# Altium project STM32MP15XXAC_1LPDDR2x32.PrjPcb
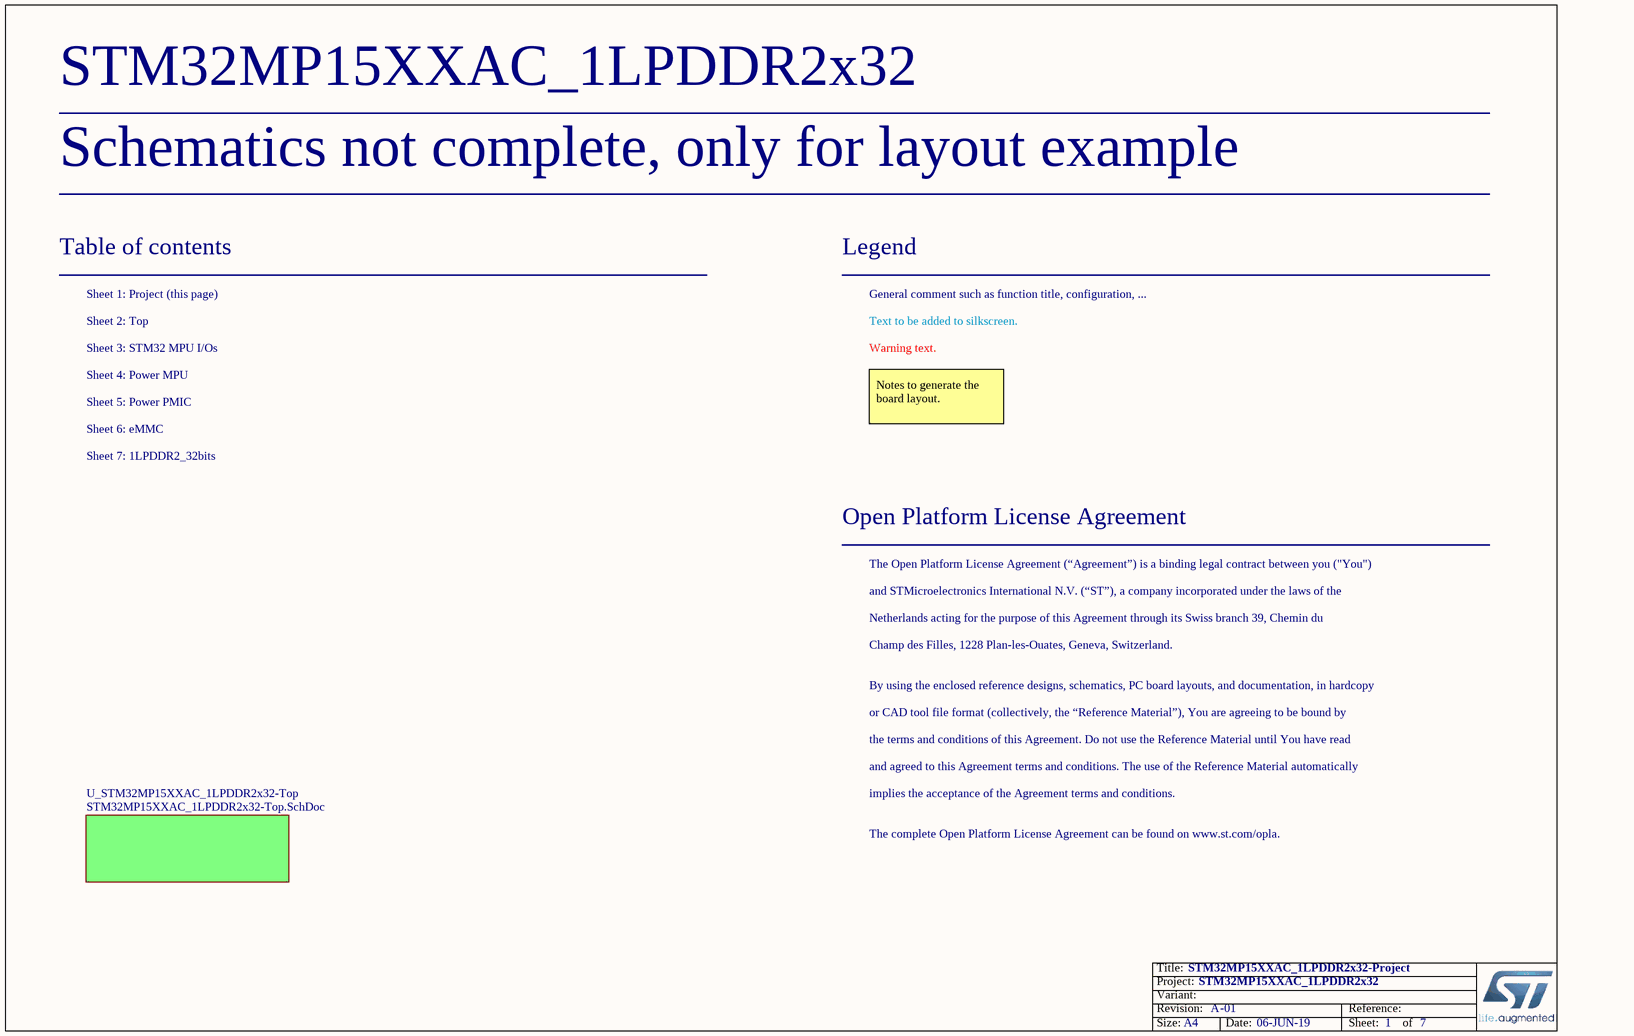
[diagram p0: STM32MP15XXAC_1LPDDR2x32-Project.SchDoc]
Board_Assembly_Revision: 01; Board_Document_Date: 06-JUN-19; Board_Name: STM32MP15XXAC_1LPDDR2x32; Board_PCB_Revision: A
7 sheets, 87 parts. Net scope: flat (ports and power ports of the same name join across sheets).
Board file: STM32MP15XXAC_1LPDDR2x32.PcbDoc
Sheets:
  STM32MP15XXAC_1LPDDR2x32-Project.SchDoc
    U_STM32MP15XXAC_1LPDDR2x32-Top = STM32MP15XXAC_1LPDDR2x32-Top.SchDoc
      U_Power_PMIC = Power_PMIC.SchDoc
      U_Power_MPU = Power_MPU.SchDoc
      U_eMMC = eMMC.SchDoc
      U_STM32_MPU_IOs = STM32_MPU_IOs.SchDoc
      U_1LPDDR2_32bits = 1LPDDR2_32bits .SchDoc

## Sheet STM32MP15XXAC_1LPDDR2x32-Project.SchDoc: STM32MP15XXAC_1LPDDR2x32-Project
size A4; ApprovedBy: Not used; CheckedBy: Not used; Author: Not used; CompanyName: STMicroelectronics; DrawnBy: Not used; Engineer: Not used; Organization: Not used; Address1: Not used; Address2: Not used; Address3: Not used; Address4: Not used; DocumentNumber: Not used; Revision: Not used; SheetNumber: 1; SheetTotal: 7; CurrentTime: Not used; CurrentDate: Not used; Time: Not used; DocumentFullPathAndName: Not used; DocumentName: Not used; ModifiedDate: Not used; ImagePath: Not used; ProjectName: Not used; Application_BuildNumber: Not used

### Sub-sheets
U_STM32MP15XXAC_1LPDDR2x32-Top = STM32MP15XXAC_1LPDDR2x32-Top.SchDoc: no entries

### Notes on the sheet
- Schematics not complete, only for layout example
- Table of contents
- Sheet 1: Project (this page)
- Legend
- General comment such as function title, configuration, ...
- Sheet 2: Top
- Sheet 3: STM32 MPU I/Os
- Sheet 4: Power MPU
- Text to be added to silkscreen.
- Warning text.
- Sheet 5: Power PMIC
- Sheet 6: eMMC
- Notes to generate the board layout.
- Sheet 7: 1LPDDR2_32bits
- Open Platform License Agreement
- The Open Platform License Agreement (“Agreement”) is a binding legal contract between you ("You")
- and STMicroelectronics International N.V. (“ST”), a company incorporated under the laws of the
- Netherlands acting for the purpose of this Agreement through its Swiss branch 39, Chemin du
- Champ des Filles, 1228 Plan-les-Ouates, Geneva, Switzerland.
- By using the enclosed reference designs, schematics, PC board layouts, and documentation, in hardcopy
- or CAD tool file format (collectively, the “Reference Material”), You are agreeing to be bound by
- the terms and conditions of this Agreement. Do not use the Reference Material until You have read
- and agreed to this Agreement terms and conditions. The use of the Reference Material automatically
- implies the acceptance of the Agreement terms and conditions.
- The complete Open Platform License Agreement can be found on www.st.com/opla.
- Title:
- Project:
- Size:
- Revision:
- Variant:
- A4
- -
- Date:
- Reference:
- Sheet:
- of

## Sheet STM32MP15XXAC_1LPDDR2x32-Top.SchDoc: STM32MP15XXAC_1LPDDR2x32-TOP
size A4; Date: Not used; ApprovedBy: Not used; CheckedBy: Not used; Author: Not used; CompanyName: STMicroelectronics; DrawnBy: Not used; Engineer: Not used; Organization: Not used; Address1: Not used; Address2: Not used; Address3: Not used; Address4: Not used; DocumentNumber: Not used; Revision: Not used; SheetNumber: 2; SheetTotal: 7; CurrentTime: Not used; CurrentDate: Not used; Time: Not used; DocumentFullPathAndName: Not used; DocumentName: Not used; ModifiedDate: Not used; ImagePath: Not used; ProjectName: Not used; Application_BuildNumber: Not used
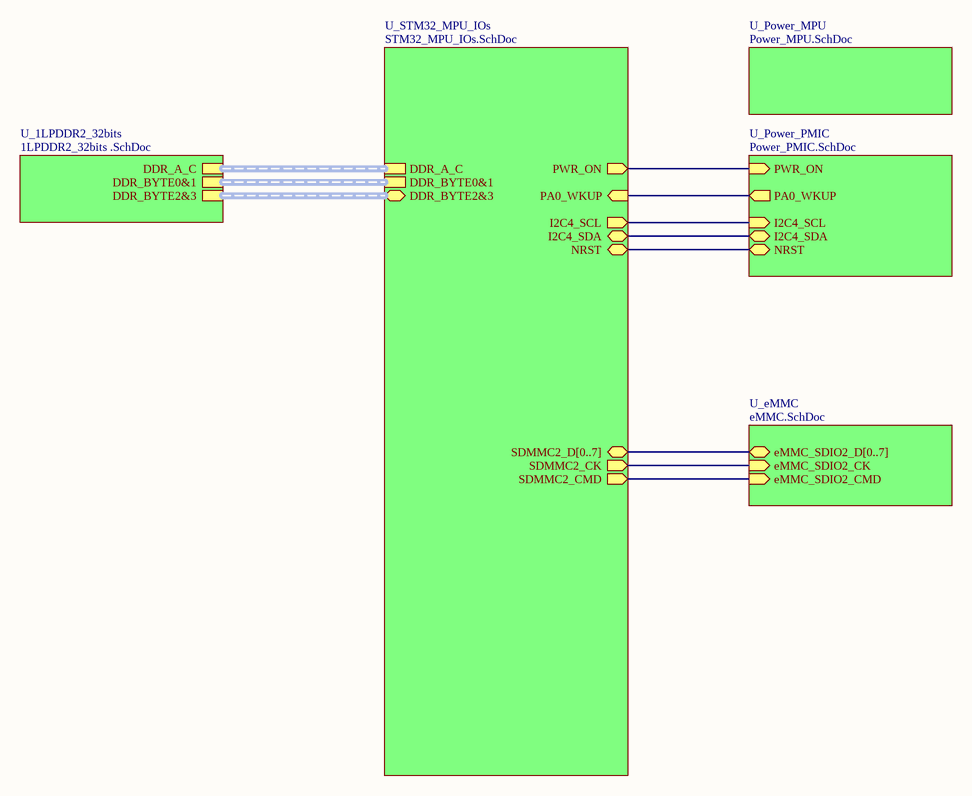
[diagram p1: STM32MP15XXAC_1LPDDR2x32-Top.SchDoc]

### Sub-sheets
U_1LPDDR2_32bits = 1LPDDR2_32bits .SchDoc: DDR_BYTE0&1 (harness DDR_BYTE_0&1), DDR_BYTE2&3 (harness DDR_BYTE_2&3), DDR_A_C (harness DDR_A_C)
U_eMMC = eMMC.SchDoc: eMMC_SDIO2_CK (in), eMMC_SDIO2_D[0..7] (bidir), eMMC_SDIO2_CMD (in)
U_Power_MPU = Power_MPU.SchDoc: no entries
U_Power_PMIC = Power_PMIC.SchDoc: I2C4_SDA (bidir), I2C4_SCL (in), PA0_WKUP (out), NRST (bidir), PWR_ON (in)
U_STM32_MPU_IOs = STM32_MPU_IOs.SchDoc: PA0_WKUP (in), NRST (bidir), PWR_ON (out), I2C4_SCL (out), I2C4_SDA (bidir), DDR_BYTE0&1 (harness DDR_BYTE_0&1), DDR_A_C (harness DDR_A_C), SDMMC2_D[0..7] (bidir), SDMMC2_CMD (out), SDMMC2_CK (out), DDR_BYTE2&3 (harness DDR_BYTE_2&3)

### Nets
(unnamed): sheet U_Power_PMIC/I2C4_SDA, sheet U_STM32_MPU_IOs/I2C4_SDA
(unnamed): sheet U_Power_PMIC/I2C4_SCL, sheet U_STM32_MPU_IOs/I2C4_SCL
(unnamed): sheet U_Power_PMIC/PA0_WKUP, sheet U_STM32_MPU_IOs/PA0_WKUP
(unnamed): sheet U_Power_PMIC/NRST, sheet U_STM32_MPU_IOs/NRST
(unnamed): sheet U_Power_PMIC/PWR_ON, sheet U_STM32_MPU_IOs/PWR_ON
(unnamed): sheet U_eMMC/eMMC_SDIO2_CK, sheet U_STM32_MPU_IOs/SDMMC2_CK
(unnamed): sheet U_eMMC/eMMC_SDIO2_CMD, sheet U_STM32_MPU_IOs/SDMMC2_CMD

### Buses and harness runs
bus sheet U_eMMC/eMMC_SDIO2_D[0..7] = sheet U_STM32_MPU_IOs/SDMMC2_D[0..7]
harness sheet U_1LPDDR2_32bits/DDR_A_C = sheet U_STM32_MPU_IOs/DDR_A_C
harness sheet U_1LPDDR2_32bits/DDR_BYTE0&1 = sheet U_STM32_MPU_IOs/DDR_BYTE0&1
harness sheet U_1LPDDR2_32bits/DDR_BYTE2&3 = sheet U_STM32_MPU_IOs/DDR_BYTE2&3

### Notes on the sheet
- Title:
- Project:
- Size:
- Revision:
- Variant:
- A4
- -
- Date:
- Reference:
- Sheet:
- of

## Sheet Power_PMIC.SchDoc: Power_PMIC
size A3; CompanyName: STMicroelectronics; Organization: Microcontrollers Division; Address1: 12, Rue Jules HOROWITZ; Address2: 38019 Grenoble; Address3: FRANCE; SheetNumber: 5; SheetTotal: 7
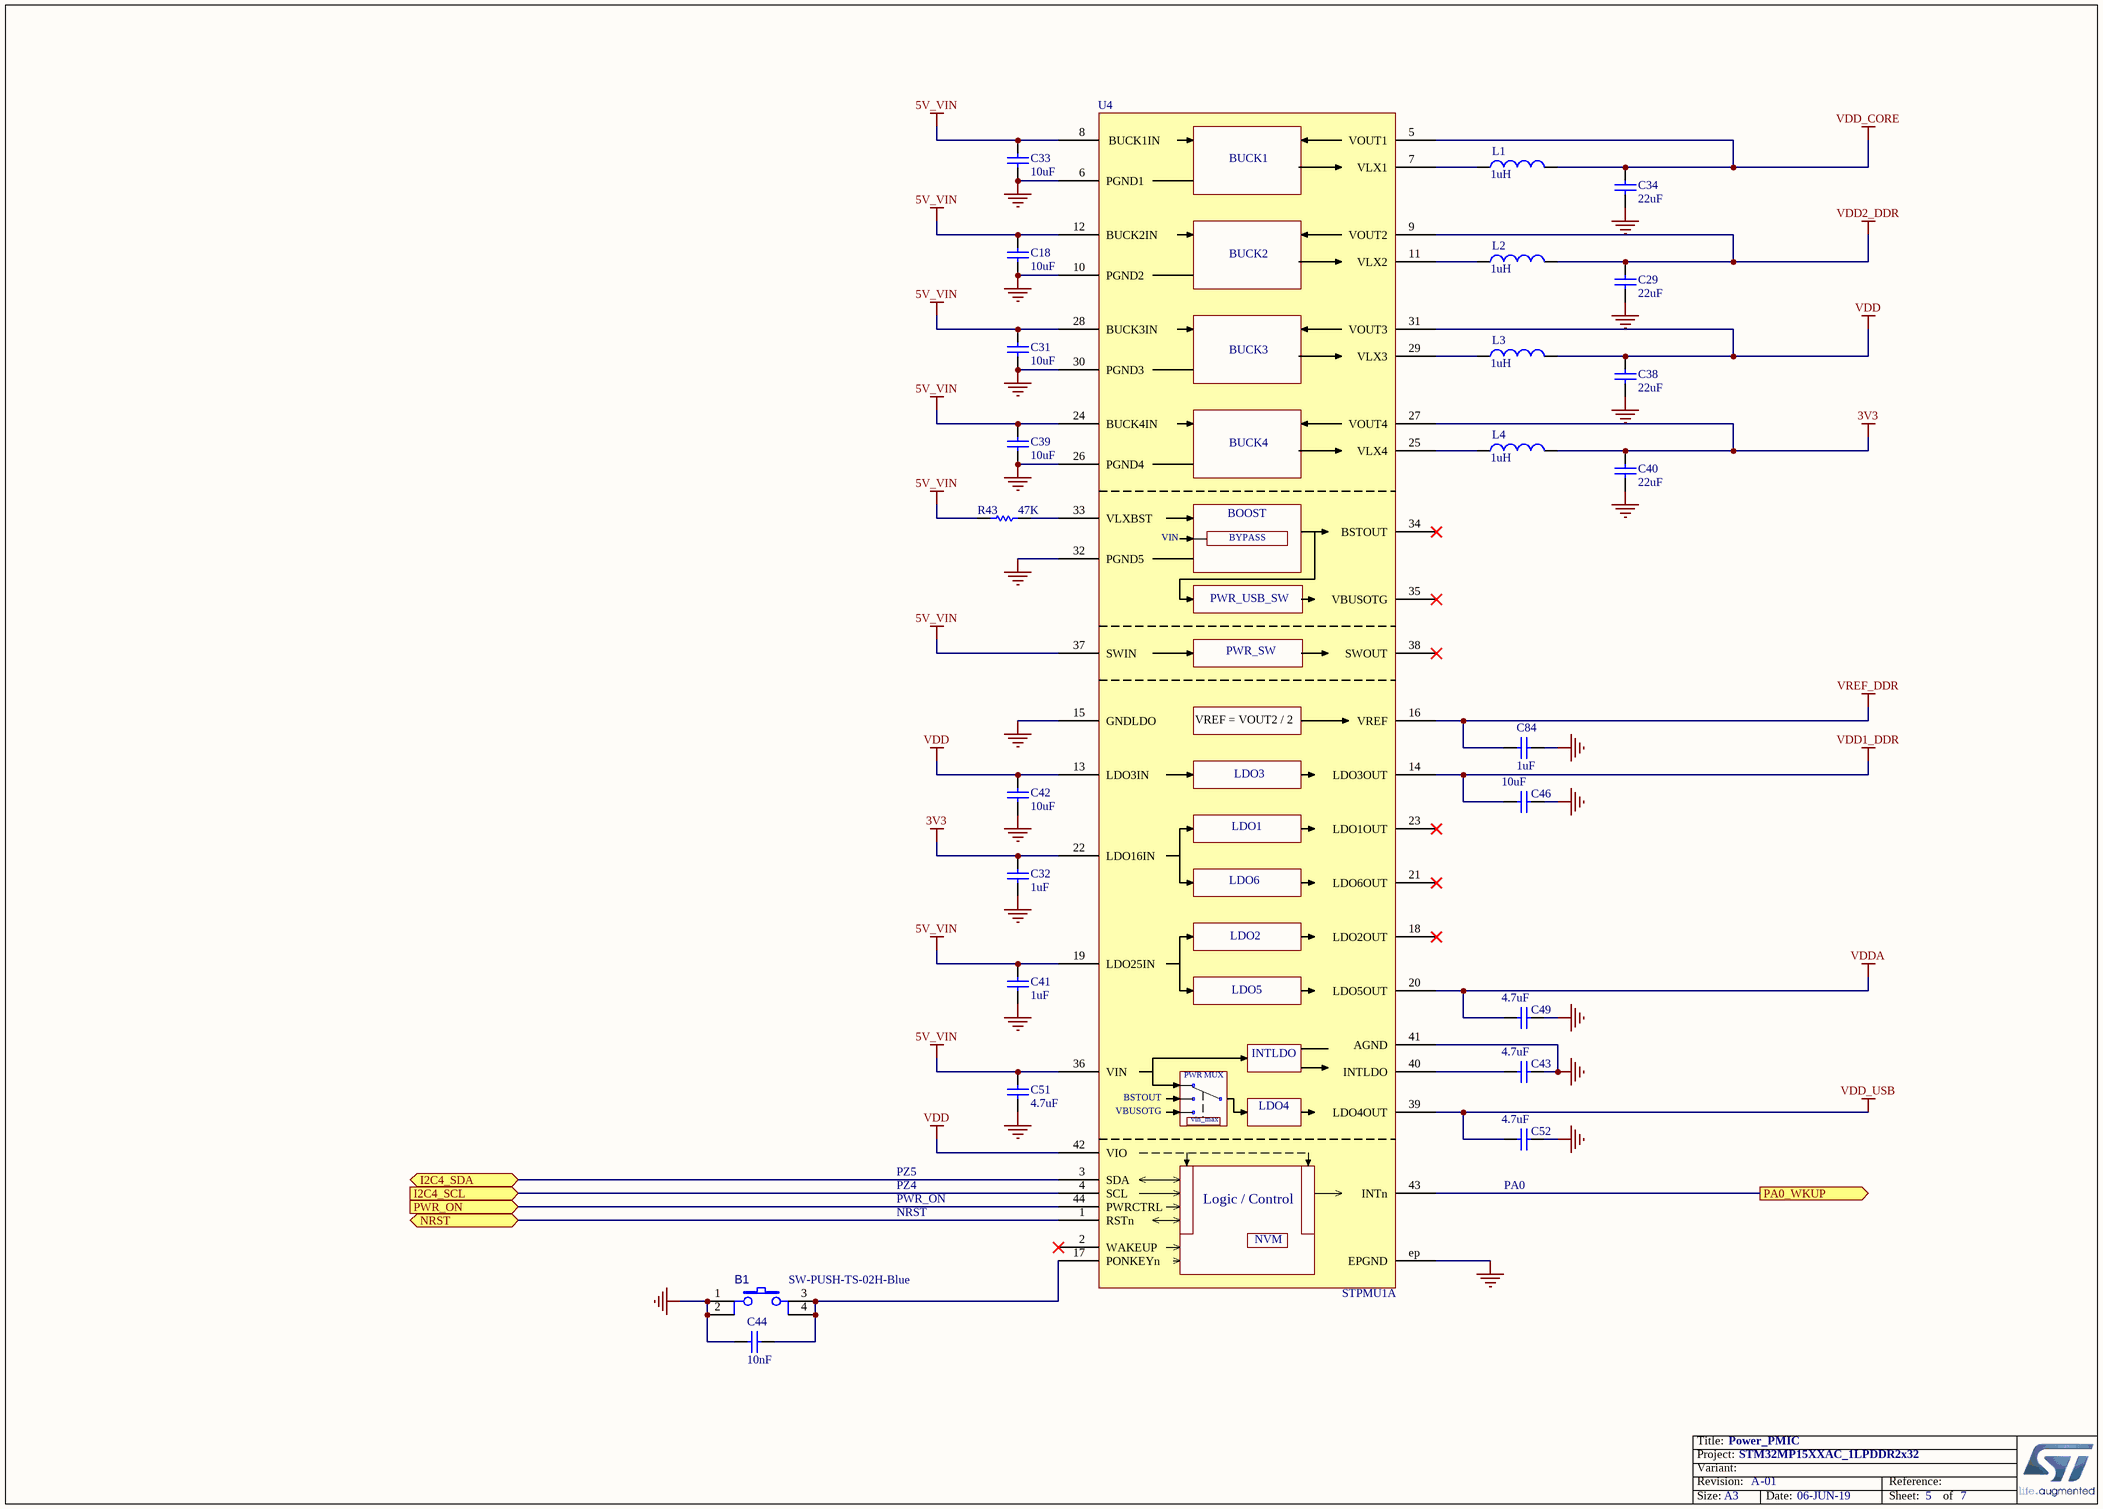
[diagram p2: Power_PMIC.SchDoc]

### Parts
B1  value SW-PUSH-TS-02H-Blue  [SWI_JIUBABA_C-TS-02H-2-5-B-V-T_R_BLUE]
C18  value 10uF  [C0603]
C29  value 22uF  [C0603]
C31  value 10uF  [C0603]
C32  value 1uF  [C0402]
C33  value 10uF  [C0603]
C34  value 22uF  [C0603]
C38  value 22uF  [C0603]
C39  value 10uF  [C0603]
C40  value 22uF  [C0603]
C41  value 1uF  [C0402]
C42  value 10uF  [C0603]
C43  value 4.7uF  [C0402]
C44  value 10nF  [C0402]
C46  value 10uF  [C0603]
C49  value 4.7uF  [C0402]
C51  value 4.7uF  [C0402]
C52  value 4.7uF  [C0402]
C84  value 1uF  [C0402]
L1  value 1uH  [IND_2520_TOKO_DFE252012P]
L2  value 1uH  [IND_2520_TOKO_DFE252012P]
L3  value 1uH  [IND_2520_TOKO_DFE252012P]
L4  value 1uH  [IND_2520_TOKO_DFE252012P]
R43  value 47K  [R0402]
U4  value STPMU1A  [ICC_WFQFN44-EPAD_5X6_P040]

### Ports
I2C4_SCL (in), I2C4_SDA (bidir), NRST (bidir), PA0_WKUP (out), PWR_ON (in)

### Nets
3V3: C32.2 C40.2 L4.2 U4.22(LDO16IN) U4.27(VOUT4)
5V_VIN: C18.2 C31.2 C33.2 C39.2 C41.2 C51.2 R43.2 U4.8(BUCK1IN) U4.12(BUCK2IN) U4.19(LDO25IN) U4.24(BUCK4IN) U4.28(BUCK3IN) U4.36(VIN) U4.37(SWIN)
GND: B1.1 B1.2 C18.1 C29.1 C31.1 C32.1 C33.1 C34.1 C38.1 C39.1 C40.1 C41.1 C42.1 C43.2 C44.1 C46.1 C49.1 C51.1 C52.1 C84.1 U4.6(PGND1) U4.10(PGND2) U4.15(GNDLDO) U4.26(PGND4) U4.30(PGND3) U4.32(PGND5) U4.41(AGND) U4.ep(EPGND)
VDD: C38.2 C42.2 L3.2 U4.13(LDO3IN) U4.31(VOUT3) U4.42(VIO)
VDD1_DDR: C46.2 U4.14(LDO3OUT)
VDD2_DDR: C29.2 L2.2 U4.9(VOUT2)
VDD_CORE: C34.2 L1.2 U4.5(VOUT1)
VDD_USB: C52.2 U4.39(LDO4OUT)
VDDA: C49.2 U4.20(LDO5OUT)
VREF_DDR: C84.2 U4.16(VREF)
I2C4_SCL: U4.4(SCL) ; port I2C4_SCL
I2C4_SDA: U4.3(SDA) ; port I2C4_SDA
NRST: U4.1(RSTn) ; port NRST
PA0_WKUP: U4.43(INTn) ; port PA0_WKUP
PWR_ON: U4.44(PWRCTRL) ; port PWR_ON
NetB1_3: B1.3 B1.4 C44.2 U4.17(PONKEYn)
NetC43_1: C43.1 U4.40(INTLDO)
NetL1_1: L1.1 U4.7(VLX1)
NetL2_1: L2.1 U4.11(VLX2)
NetL3_1: L3.1 U4.29(VLX3)
NetL4_1: L4.1 U4.25(VLX4)
NetR43_1: R43.1 U4.33(VLXBST)

Not connected (* = marked no-connect by the designer): U4 2(WAKEUP)* 18(LDO2OUT)* 21(LDO6OUT)* 23(LDO1OUT)* 34(BSTOUT)* 35(VBUSOTG)* 38(SWOUT)*

### Notes on the sheet
- PZ5
- PZ4
- (near C52) PA0
- NRST
- PWR_ON
- Title:
- Project:
- Size:
- Revision:
- Variant:
- A3
- -
- Date:
- Reference:
- Sheet:
- of
- (in symbol MCD-00303) BUCK1; BUCK2; BUCK3; BUCK4; BOOST; BYPASS; PWR_USB_SW; PWR_SW; VREF = VOUT2 / 2; LDO3; LDO1; LDO6; LDO2; LDO5; PWR MUX; LDO4; vin_max; Logic / Control; NVM

### Library data of the parts
B1 = MCD-00172: Switch HW SMD blue; Part_Type: Misc; Manufacturer_Part_Number: C-TS-02H-2.5-B-V-T/R BLUE; Manufacturer: JIUBABA; Provided_By: SUBCO; Internal_Part_Number: MCD-00172; Status: Checked; ComponentLink1Description: Datasheet; ComponentLink1URL: http://tunmcdsvn.tun.st.com/Component_Datasheet_Library/Trunk/Misc/Jiubaba_TS-02H-H2-5; ECCN_US: n/a; ECCN_EU: n/a
C18 C31 C33 C39 C42 = MCD-00099: Capacitor, MLCC, 10uF, 10V, X5R, 10%, 0603, T=0,8mm; Manufacturer_Part_Number: GRM188R61A106KE69D; Manufacturer: MURATA; Provided_By: SUBCO; ECCN_US: EAR99; ECCN_EU: NEC; Internal_Part_Number: MCD-00099; Status: Released; Part_Type: Capacitor; Package: C0603; ComponentLink1Description: Datasheet; ComponentLink1URL: http://tunmcdsvn.tun.st.com/Component_Datasheet_Library/Trunk/Capacitors/Murata_Capacitor_GR_series
C29 C34 C38 C40 = MCD-00100: Capacitor, MLCC, 22uF, 6V3, X5R, 20%, 0603, T=0,8mm; Manufacturer_Part_Number: GRM188R60J226MEA0J; Manufacturer: MURATA; Provided_By: SUBCO; ECCN_US: EAR99; ECCN_EU: NEC; Internal_Part_Number: MCD-00100; Status: Released; Part_Type: Capacitor; Package: C0603; ComponentLink1Description: Datasheet; ComponentLink1URL: http://tunmcdsvn.tun.st.com/Component_Datasheet_Library/Trunk/Capacitors/Murata_Capacitor_GR_series
C32 C41 C84 = MCD-00095: Capacitor, MLCC, 1uF, 25V, X5R, 10%, 0402, T=0,5mm; Manufacturer_Part_Number: GRM155R61E105KA12; Manufacturer: MURATA; Alternate_Manufacturer_Part_Number: GRM155R60J105KE19; Provided_By: SUBCO; ECCN_US: EAR99; ECCN_EU: NEC; Internal_Part_Number: MCD-00095; Status: Released; Part_Type: Capacitor; Package: C0402; ComponentLink1Description: Datasheet; ComponentLink1URL: http://tunmcdsvn.tun.st.com/Component_Datasheet_Library/Trunk/Capacitors/Murata_Capacitor_GR_series; Alternate_Manufacturer: MURATA
C43 C49 C51 C52 = MCD-00096: Capacitor, MLCC, 4.7uF, 6V3, X5R, 20%, 0402, T=0,5mm; Manufacturer_Part_Number: GRM155R60J475ME87; Manufacturer: MURATA; Provided_By: SUBCO; ECCN_US: EAR99; ECCN_EU: NEC; Internal_Part_Number: MCD-00096; Status: Obsolete; Part_Type: Capacitor; Package: C0402; ComponentLink1Description: Datasheet; ComponentLink1URL: http://tunmcdsvn.tun.st.com/Component_Datasheet_Library/Trunk/Capacitors/Murata_Capacitor_GR_series
C44 = MCD-00011: Capacitor, MLCC, 10nF, 16V, X7R, 10%, 0402, T=0.5mm; Manufacturer_Part_Number: CC0402KRX7R7BB103; Manufacturer: YAGEO; Provided_By: SUBCO; ECCN_US: EAR99; ECCN_EU: NEC; Internal_Part_Number: MCD-00011; Status: Released; Part_Type: Capacitor; Package: C0402; ComponentLink1Description: Datasheet; ComponentLink1URL: http://tunmcdsvn.tun.st.com/Component_Datasheet_Library/Trunk/Capacitors/Yageo_Multilayer_Capacitor_X7R_series_100pF_to_22uF
C46 = MCD-00099: Capacitor, MLCC, 10uF, 10V, X5R, 10%, 0603, T=0,8mm; Manufacturer_Part_Number: GRM188R61A106KE69D; Manufacturer: MURATA; ECCN_US: EAR99; ECCN_EU: NEC; Provided_By: SUBCO; Internal_Part_Number: MCD-00099; Status: Released; Part_Type: Capacitor; Package: C0603; ComponentLink1Description: Datasheet; ComponentLink1URL: http://tunmcdsvn.tun.st.com/Component_Datasheet_Library/Trunk/Capacitors/Murata_Capacitor_GR_series
L1-L4 = MCD-01122: Power Inductor ,1uH,4.3A max,+/-20%,0.042ohm,2520; Manufacturer_Part_Number: DFE252012P-1ROM=P2; Manufacturer: MURATA; Provided_By: SUBCO; ECCN_US: EAR99; Internal_Part_Number: MCD-01122; Status: Footprint available; Part_Type: Inductor; Package: 2520; ComponentLink1Description: Datasheet; ComponentLink1URL: http://tunmcdsvn.tun.st.com/Component_Datasheet_Library/Trunk/Inductors/Murata_Power_inductors_DFE252012P-1ROM=P2/Murata_Power_inductors_dfe252012p.pdf; ECCN_EU: EAR99
R43 = MCD-00063: Resistor,47K,0402,1%,1/16W; Manufacturer_Part_Number: RC0402FR-0747KL; Manufacturer: YAGEO; Provided_By: SUBCO; ECCN_US: EAR99; ECCN_EU: NEC; Internal_Part_Number: MCD-00063; Status: Released; Part_Type: Resistor; Package: R0402; ComponentLink1Description: Datasheet; ComponentLink1URL: http://tunmcdsvn.tun.st.com/Component_Datasheet_Library/Trunk/Resistors/Yageo_Resistor_RC0402-series
U4 = MCD-00303: STM PMIC WFQFN 5.0x6.0x0.80 44L 0.4 pitch; Part_Type: IC; Manufacturer_Part_Number: STPMU1APQR; Manufacturer: STMICROELECTRONICS; BMS_Part_Number: 9177718; Provided_By: SUBCO with ST control; ECCN_US: EAR99; ECCN_EU: NEC; Internal_Part_Number: MCD-00303; Status: Obsolete; ComponentLink1Description: Datasheet; ComponentLink1URL: http://tunmcdsvn.tun.st.com/Component_Datasheet_Library/Trunk/IC/STM_PMIC_LuftBurg_5x6_44L_20_01_2016

## Sheet Power_MPU.SchDoc: Power_MPU
size A3; CompanyName: STMicroelectronics; SheetNumber: 4; SheetTotal: 7
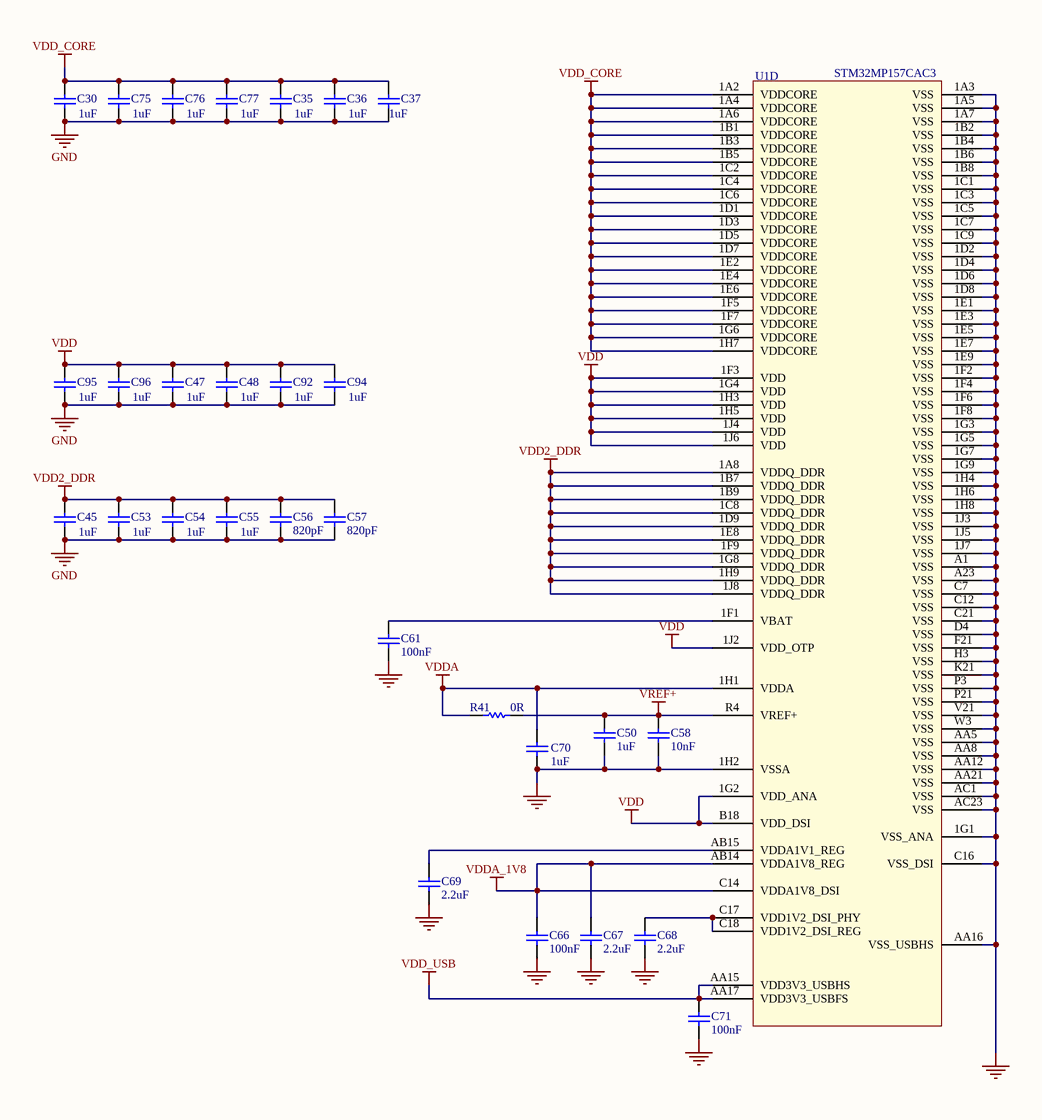
[diagram p3: Power_MPU.SchDoc]

### Parts
C30  value 1uF  [C0402]
C35  value 1uF  [C0402]
C36  value 1uF  [C0402]
C37  value 1uF  [C0402]
C45  value 1uF  [C0402]
C47  value 1uF  [C0402]
C48  value 1uF  [C0402]
C50  value 1uF  [C0402]
C53  value 1uF  [C0402]
C54  value 1uF  [C0402]
C55  value 1uF  [C0402]
C56  value 820pF  [C0402]
C57  value 820pF  [C0402]
C58  value 10nF  [C0402]
C61  value 100nF  [C0402]
C66  value 100nF  [C0402]
C67  value 2.2uF  [C0402]
C68  value 2.2uF  [C0402]
C69  value 2.2uF  [C0402]
C70  value 1uF  [C0402]
C71  value 100nF  [C0402]
C75  value 1uF  [C0402]
C76  value 1uF  [C0402]
C77  value 1uF  [C0402]
C92  value 1uF  [C0402]
C94  value 1uF  [C0402]
C95  value 1uF  [C0402]
C96  value 1uF  [C0402]
R41  value 0R  [R0402]
U1  value STM32MP157CAC3  [ICC_TFBGA361_12X12_STM32MP157CAC3_P050-065]  (part D of 5)

### Nets
GND: C30.1 C35.1 C36.1 C37.1 C45.1 C47.1 C48.1 C50.1 C53.1 C54.1 C55.1 C56.1 C57.1 C58.1 C61.1 C66.1 C67.1 C68.1 C69.1 C70.1 C71.1 C75.1 C76.1 C77.1 C92.1 C94.1 C95.1 C96.1 U1.1A3(VSS) U1.1A5(VSS) U1.1A7(VSS) U1.1B2(VSS) U1.1B4(VSS) U1.1B6(VSS) U1.1B8(VSS) U1.1C1(VSS) U1.1C3(VSS) U1.1C5(VSS) U1.1C7(VSS) U1.1C9(VSS) U1.1D2(VSS) U1.1D4(VSS) U1.1D6(VSS) U1.1D8(VSS) U1.1E1(VSS) U1.1E3(VSS) U1.1E5(VSS) U1.1E7(VSS) U1.1E9(VSS) U1.1F2(VSS) U1.1F4(VSS) U1.1F6(VSS) U1.1F8(VSS) U1.1G1(VSS_ANA) U1.1G3(VSS) U1.1G5(VSS) U1.1G7(VSS) U1.1G9(VSS) U1.1H2(VSSA) U1.1H4(VSS) U1.1H6(VSS) U1.1H8(VSS) U1.1J3(VSS) U1.1J5(VSS) U1.1J7(VSS) U1.A1(VSS) U1.A23(VSS) U1.AA5(VSS) U1.AA8(VSS) U1.AA12(VSS) U1.AA16(VSS_USBHS) U1.AA21(VSS) U1.AC1(VSS) U1.AC23(VSS) U1.C7(VSS) U1.C12(VSS) U1.C16(VSS_DSI) U1.C21(VSS) U1.D4(VSS) U1.F21(VSS) U1.H3(VSS) U1.K21(VSS) U1.P3(VSS) U1.P21(VSS) U1.V21(VSS) U1.W3(VSS)
VDD: C47.2 C48.2 C92.2 C94.2 C95.2 C96.2 U1.1F3(VDD) U1.1G2(VDD_ANA) U1.1G4(VDD) U1.1H3(VDD) U1.1H5(VDD) U1.1J2(VDD_OTP) U1.1J4(VDD) U1.1J6(VDD) U1.B18(VDD_DSI)
VDD2_DDR: C45.2 C53.2 C54.2 C55.2 C56.2 C57.2 U1.1A8(VDDQ_DDR) U1.1B7(VDDQ_DDR) U1.1B9(VDDQ_DDR) U1.1C8(VDDQ_DDR) U1.1D9(VDDQ_DDR) U1.1E8(VDDQ_DDR) U1.1F9(VDDQ_DDR) U1.1G8(VDDQ_DDR) U1.1H9(VDDQ_DDR) U1.1J8(VDDQ_DDR)
VDD_CORE: C30.2 C35.2 C36.2 C37.2 C75.2 C76.2 C77.2 U1.1A2(VDDCORE) U1.1A4(VDDCORE) U1.1A6(VDDCORE) U1.1B1(VDDCORE) U1.1B3(VDDCORE) U1.1B5(VDDCORE) U1.1C2(VDDCORE) U1.1C4(VDDCORE) U1.1C6(VDDCORE) U1.1D1(VDDCORE) U1.1D3(VDDCORE) U1.1D5(VDDCORE) U1.1D7(VDDCORE) U1.1E2(VDDCORE) U1.1E4(VDDCORE) U1.1E6(VDDCORE) U1.1F5(VDDCORE) U1.1F7(VDDCORE) U1.1G6(VDDCORE) U1.1H7(VDDCORE)
VDD_USB: C71.2 U1.AA15(VDD3V3_USBHS) U1.AA17(VDD3V3_USBFS)
VDDA: C70.2 R41.1 U1.1H1(VDDA)
VDDA_1V8: C66.2 C67.2 U1.AB14(VDDA1V8_REG) U1.C14(VDDA1V8_DSI)
VREF+: C50.2 C58.2 R41.2 U1.R4(VREF+)
NetC61_2: C61.2 U1.1F1(VBAT)
NetC68_2: C68.2 U1.C17(VDD1V2_DSI_PHY) U1.C18(VDD1V2_DSI_REG)
NetC69_2: C69.2 U1.AB15(VDDA1V1_REG)

### Notes on the sheet
- Title:
- Project:
- Size:
- Revision:
- Variant:
- A3
- -
- Date:
- Reference:
- Sheet:
- of

### Library data of the parts
C30 C35-C37 C45 C47 C48 C50 C53-C55 C70 C75-C77 C92 C94-C96 = MCD-00095: Capacitor, MLCC, 1uF, 25V, X5R, 10%, 0402, T=0,5mm; Manufacturer_Part_Number: GRM155R61E105KA12; Manufacturer: MURATA; Alternate_Manufacturer_Part_Number: GRM155R60J105KE19; ECCN_US: EAR99; ECCN_EU: NEC; Provided_By: SUBCO; Internal_Part_Number: MCD-00095; Status: Released; Package: C0402; ComponentLink1Description: Datasheet; Part_Type: Capacitor; Alternate_Manufacturer: MURATA; ComponentLink1URL: http://tunmcdsvn.tun.st.com/Component_Datasheet_Library/Trunk/Capacitors/Murata_Capacitor_GR_series
C56 C57 = MCD-01508: Capacitor, MLCC, 820pF, 50V, X7R, 10%, 0402, T=0.55mm; Manufacturer_Part_Number: CC0402KRX7R9BB821; Manufacturer: YAGEO; Provided_By: SUBCO; Internal_Part_Number: MCD-01508; Status: Footprint available; Part_Type: Capacitor; Package: C0402; ComponentLink1Description: Datasheet; ComponentLink1URL: http://tunmcdsvn.tun.st.com/Component_Datasheet_Library/Trunk/Capacitors/Yageo_Multilayer_Capacitor_X7R_series_100pF_to_22uF/Yageo_Mutilayer_Capacitor_X7R_100pF_to_22uF.pdf; ECCN_US: N/A; ECCN_EU: N/A
C58 = MCD-00011: Capacitor, MLCC, 10nF, 16V, X7R, 10%, 0402, T=0.5mm; Manufacturer_Part_Number: CC0402KRX7R7BB103; Manufacturer: YAGEO; ECCN_US: EAR99; ECCN_EU: NEC; Provided_By: SUBCO; Internal_Part_Number: MCD-00011; Status: Released; Part_Type: Capacitor; Package: C0402; ComponentLink1Description: Datasheet; ComponentLink1URL: http://tunmcdsvn.tun.st.com/Component_Datasheet_Library/Trunk/Capacitors/Yageo_Multilayer_Capacitor_X7R_series_100pF_to_22uF
C61 C66 C71 = MCD-00006: Capacitor, MLCC, 100nF, 16V, X7R, 10%, 0402, T=0.5mm; Manufacturer_Part_Number: CC0402KRX7R7BB104; Manufacturer: YAGEO; Alternate_Manufacturer_Part_Number: GCM155R71C104KA55D; Alternate_Manufacturer: MURATA; ECCN_US: EAR99; ECCN_EU: NEC; Provided_By: SUBCO; Internal_Part_Number: MCD-00006; ComponentLink1Description: Datasheet; Status: Released; Part_Type: Capacitor; Package: C0402; ComponentLink1URL: http://tunmcdsvn.tun.st.com/Component_Datasheet_Library/Trunk/Capacitors/Yageo_Multilayer_Capacitor_X7R_series_100pF_to_22uF
C67-C69 = MCD-01823: Capacitor,MLCC,2.2uF,6V3,X5R,10%,0402,T=0.5; Manufacturer_Part_Number: GRM155R60J225KE95D; Manufacturer: MURATA; ECCN_US: EAR99; ECCN_EU: NEC; Provided_By: SUBCO; Internal_Part_Number: MCD-01823; Status: Checked; Part_Type: Capacitor; Package: C0402; ComponentLink1Description: Datasheet; ComponentLink1URL: http://tunmcdsvn.tun.st.com/Component_Datasheet_Library/Trunk/Capacitors/Murata_Capacitor_GR_series
R41 = MCD-00052: Resistor,0R,0402,5%,1/16W; Manufacturer_Part_Number: RC0402JR-070RL; Manufacturer: YAGEO; ECCN_US: EAR99; ECCN_EU: NEC; Provided_By: SUBCO; Internal_Part_Number: MCD-00052; Status: Released; Part_Type: Resistor; ComponentLink1Description: Datasheet; ComponentLink1URL: http://tunmcdsvn.tun.st.com/Component_Datasheet_Library/Trunk/Resistors/Yageo_Resistor_RC0402-series; Package: R0402
U1 = MCD-00677: MPU TFBGA12x12 secure boot+crypto; Part_Type: IC; Manufacturer: STMICROELECTRONICS; BMS_Part_Number: 9175503; ECCN_US: 5A002A4; ECCN_EU: NEC; Provided_By: SUBCO with ST control; Internal_Part_Number: MCD-00677; Status: Footprint available; Manufacturer_Part_Number: STM32MP157CAC3; ComponentLink1Description: Datasheet; ComponentLink1URL: http://tunmcdsvn.tun.st.com/Component_Datasheet_Library/Trunk/IC/STM_MPU_12x12_POA_DM00342580_POA12x12

## Sheet eMMC.SchDoc: eMMC
size A3; CompanyName: STMicroelectronics; Address1: 12, Rue Jules HOROWITZ; Address2: 38019 Grenoble; Address3: FRANCE; SheetNumber: 6; SheetTotal: 7
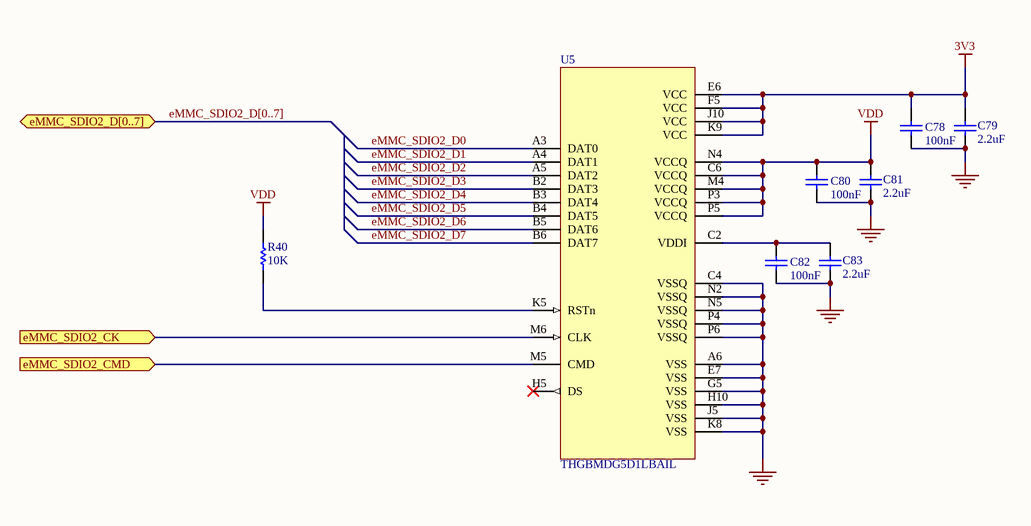
[diagram p4: eMMC.SchDoc]

### Parts
C78  value 100nF  [C0402]
C79  value 2.2uF  [C0603]
C80  value 100nF  [C0402]
C81  value 2.2uF  [C0603]
C82  value 100nF  [C0402]
C83  value 2.2uF  [C0603]
R40  value 10K  [R0402]
U5  value THGBMDG5D1LBAIL  [ICC_P-WFBGA153_13X11P5_P050]

### Ports
eMMC_SDIO2_CK (in), eMMC_SDIO2_CMD (in), eMMC_SDIO2_D[0..7] (bidir)

### Nets
3V3: C78.2 C79.2 U5.E6(VCC) U5.F5(VCC) U5.J10(VCC) U5.K9(VCC)
GND: C78.1 C79.1 C80.1 C81.1 C82.1 C83.1 U5.A6(VSS) U5.C4(VSSQ) U5.E7(VSS) U5.G5(VSS) U5.H10(VSS) U5.J5(VSS) U5.K8(VSS) U5.N2(VSSQ) U5.N5(VSSQ) U5.P4(VSSQ) U5.P6(VSSQ)
VDD: C80.2 C81.2 R40.2 U5.C6(VCCQ) U5.M4(VCCQ) U5.N4(VCCQ) U5.P3(VCCQ) U5.P5(VCCQ)
eMMC_SDIO2_CK: U5.M6(CLK) ; port eMMC_SDIO2_CK
eMMC_SDIO2_CMD: U5.M5(CMD) ; port eMMC_SDIO2_CMD
eMMC_SDIO2_D0: U5.A3(DAT0)
eMMC_SDIO2_D1: U5.A4(DAT1)
eMMC_SDIO2_D2: U5.A5(DAT2)
eMMC_SDIO2_D3: U5.B2(DAT3)
eMMC_SDIO2_D4: U5.B3(DAT4)
eMMC_SDIO2_D5: U5.B4(DAT5)
eMMC_SDIO2_D6: U5.B5(DAT6)
eMMC_SDIO2_D7: U5.B6(DAT7)
NetC82_2: C82.2 C83.2 U5.C2(VDDI)
NetR40_1: R40.1 U5.K5(RSTn)

Not connected (* = marked no-connect by the designer): U5 H5(DS)*

### Buses and harness runs
bus eMMC_SDIO2_D[0..7] = port eMMC_SDIO2_D[0..7]

### Notes on the sheet
- Title:
- Project:
- Size:
- Revision:
- Variant:
- A3
- -
- Date:
- Reference:
- Sheet:
- of

### Library data of the parts
C78 C80 C82 = MCD-00006: Capacitor, MLCC, 100nF, 16V, X7R, 10%, 0402, T=0.5mm; Manufacturer_Part_Number: CC0402KRX7R7BB104; Manufacturer: YAGEO; Alternate_Manufacturer_Part_Number: GCM155R71C104KA55D; Alternate_Manufacturer: MURATA; Provided_By: SUBCO; ECCN_US: EAR99; ECCN_EU: NEC; Internal_Part_Number: MCD-00006; Status: Released; Part_Type: Capacitor; Package: C0402; ComponentLink1Description: Datasheet; ComponentLink1URL: http://tunmcdsvn.tun.st.com/Component_Datasheet_Library/Trunk/Capacitors/Yageo_Multilayer_Capacitor_X7R_series_100pF_to_22uF
C79 C81 C83 = MCD-00012: Capacitor, MLCC, 2.2uF, 10V, X5R, 10%, 0603, T=0,8mm; Manufacturer_Part_Number: CC0603KRX5R6BB225; Manufacturer: YAGEO; Alternate_Manufacturer_Part_Number: C0603C225K8PACTU; Alternate_Manufacturer: KEMET; BMS_Part_Number: 9142010; Provided_By: SUBCO; ECCN_US: EAR99; ECCN_EU: NEC; Internal_Part_Number: MCD-00012; Status: Released; Part_Type: Capacitor; Package: C0603; ComponentLink1Description: Datasheet; ComponentLink1URL: http://tunmcdsvn.tun.st.com/Component_Datasheet_Library/Trunk/Capacitors/Yageo_Multilayer_capacitor_X5R_series_100pF_to_100uF
R40 = MCD-00053: Resistor,10K,0402,1%,1/16W; Manufacturer_Part_Number: RC0402FR-0710KL; Manufacturer: YAGEO; BMS_Part_Number: 9131590; Provided_By: SUBCO; ECCN_US: EAR99; ECCN_EU: NEC; Internal_Part_Number: MCD-00053; Status: Released; Part_Type: Resistor; Package: R0402; ComponentLink1Description: Datasheet; ComponentLink1URL: http://tunmcdsvn.tun.st.com/Component_Datasheet_Library/Trunk/Resistors/Yageo_Resistor_RC0402-series
U5 = MCD-00110: Memory,e-MMC,4GB,3V3,WFBGA,153pins; Part_Type: IC; Manufacturer: TOSHIBA; BMS_Part_Number: 9171005; Provided_By: SUBCO; ECCN_US: 3A991; ECCN_EU: NEC; Internal_Part_Number: MCD-00110; Status: Obsolete; Manufacturer_Part_Number: THGBMDG5D1LBAIL; ComponentLink1Description: Datasheet; ComponentLink1URL: http://tunmcdsvn.tun.st.com/Component_Datasheet_Library/Trunk/IC/Toshiba_eMMC_THGBMDG5D1LBAIL_20151201

## Sheet STM32_MPU_IOs.SchDoc: MPU
size A3; SheetNumber: 3; SheetTotal: 7
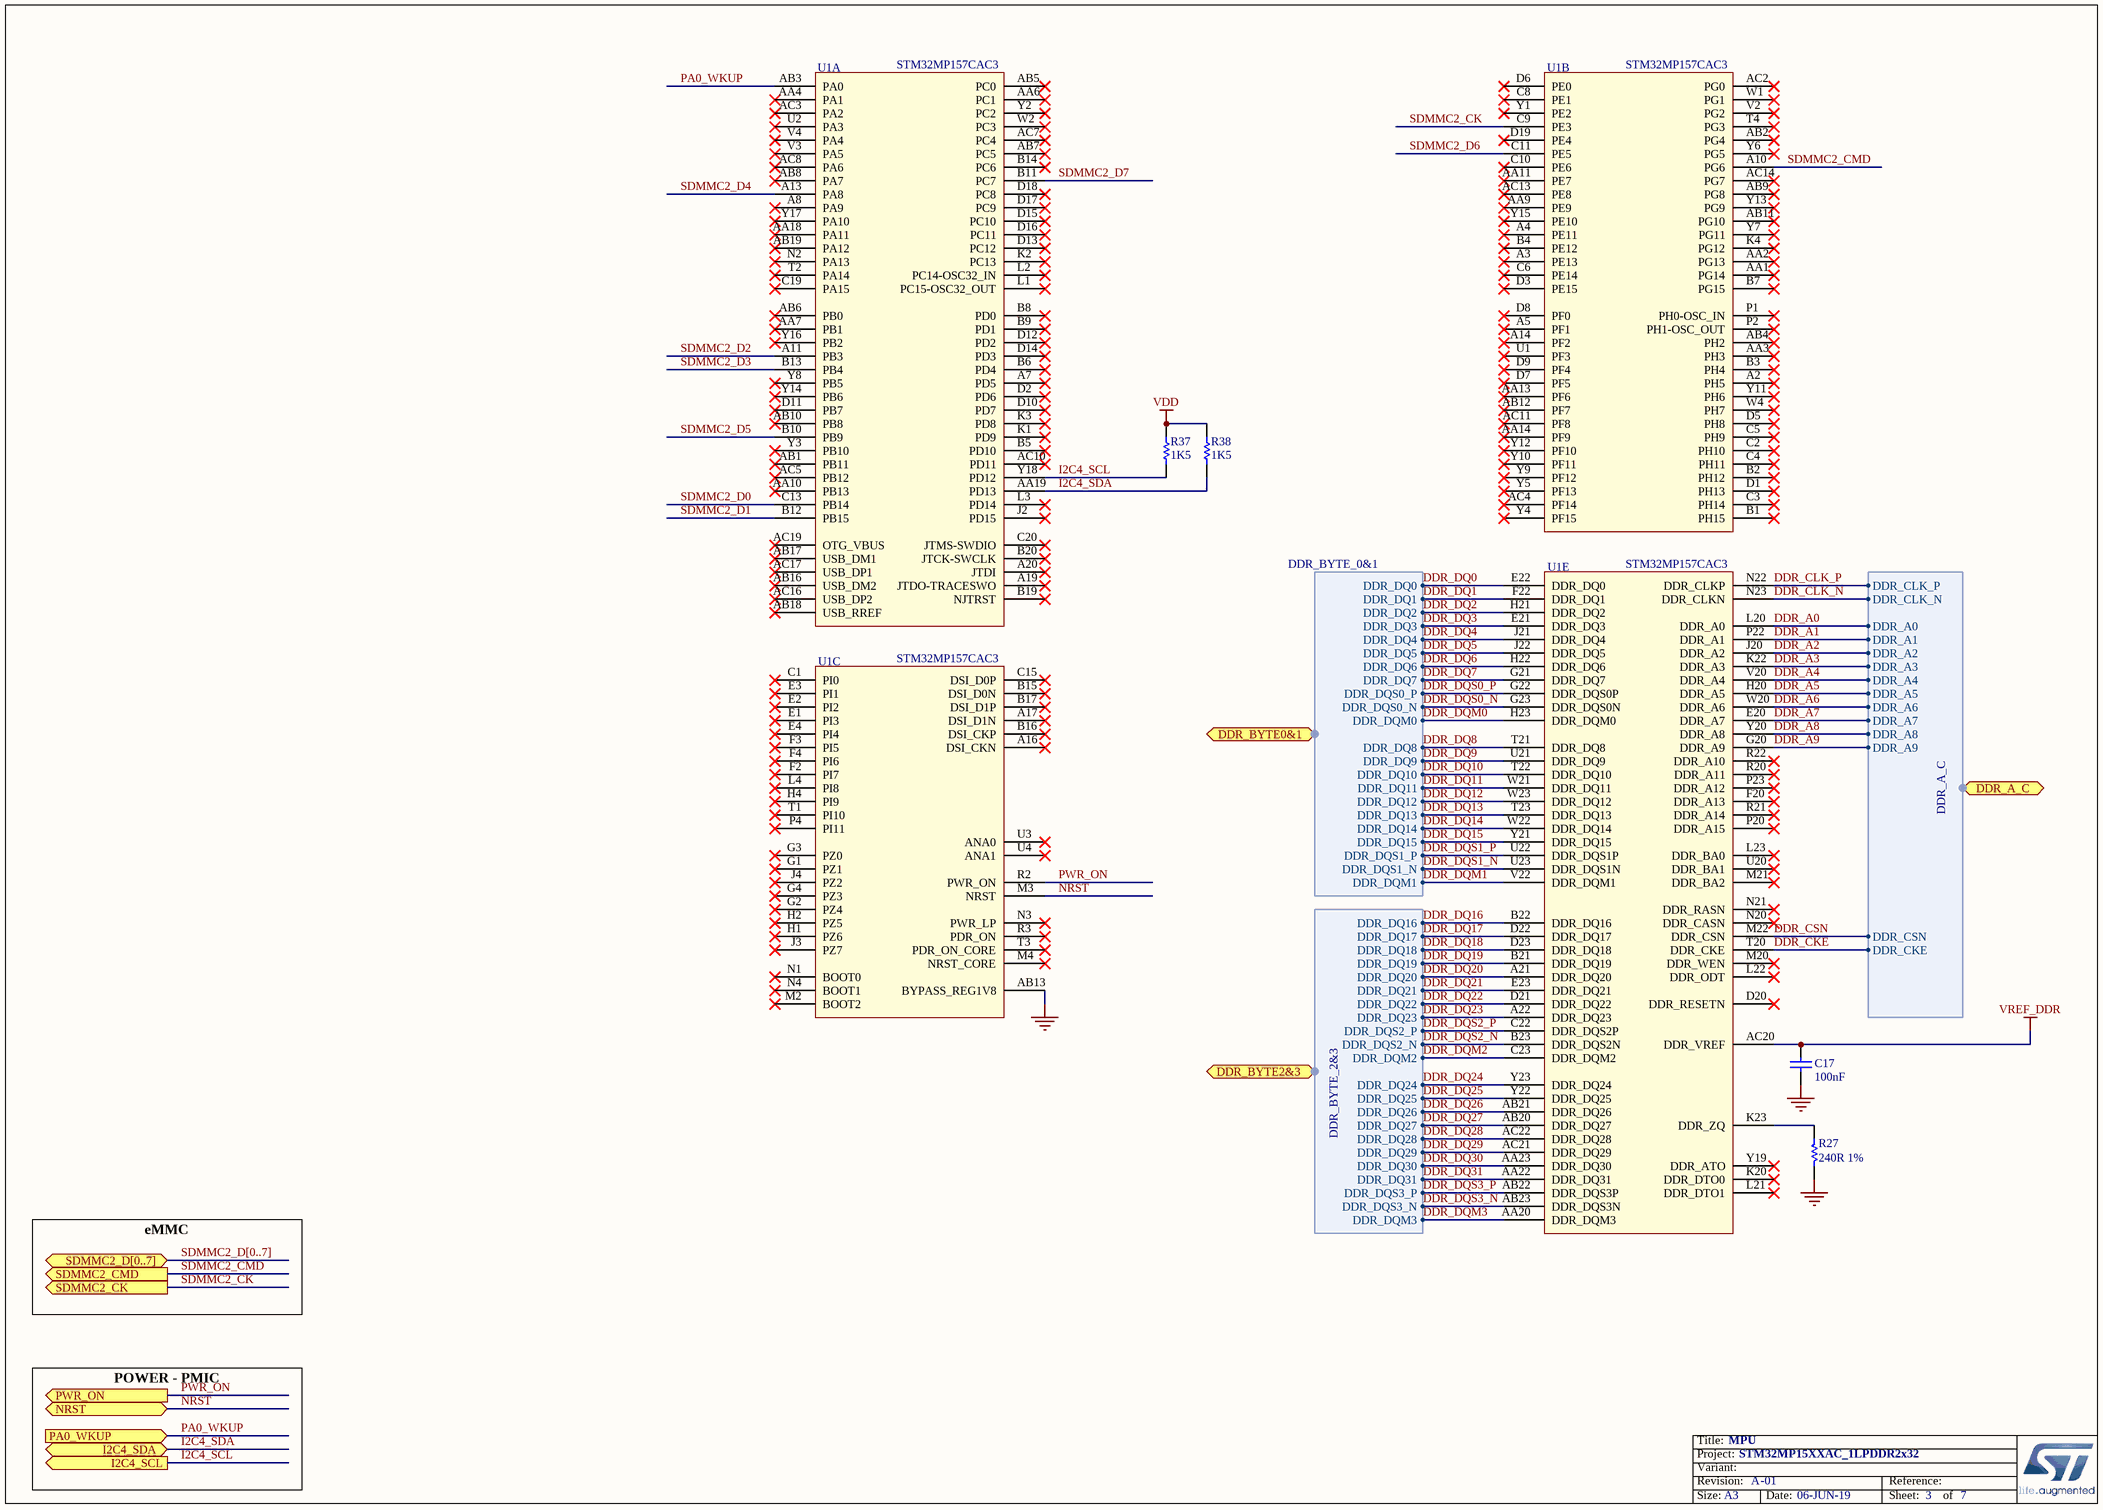
[diagram p5: STM32_MPU_IOs.SchDoc]

### Parts
C17  value 100nF  [C0402]
R27  value 240R 1%  [R0402]
R37  value 1K5  [R0402]
R38  value 1K5  [R0402]
U1  value STM32MP157CAC3  [ICC_TFBGA361_12X12_STM32MP157CAC3_P050-065]  (parts A,B,C,E of 5)

### Ports
DDR_A_C (harness DDR_A_C), DDR_BYTE0&1 (harness DDR_BYTE_0&1), DDR_BYTE2&3 (harness DDR_BYTE_2&3), I2C4_SCL (out), I2C4_SDA (bidir), NRST (bidir), PA0_WKUP (in), PWR_ON (out), SDMMC2_CK (out), SDMMC2_CMD (out), SDMMC2_D[0..7] (bidir)

### Harnesses
DDR_BYTE_0&1: DDR_DQ0, DDR_DQ1, DDR_DQ2, DDR_DQ3, DDR_DQ4, DDR_DQ5, DDR_DQ6, DDR_DQ7, DDR_DQS0_P, DDR_DQS0_N, DDR_DQM0, DDR_DQ8, DDR_DQ9, DDR_DQ10, DDR_DQ11, DDR_DQ12, DDR_DQ13, DDR_DQ14, DDR_DQ15, DDR_DQS1_P, DDR_DQS1_N, DDR_DQM1
DDR_BYTE_2&3: DDR_DQ20, DDR_DQ16, DDR_DQ18, DDR_DQ17, DDR_DQ22, DDR_DQ19, DDR_DQ21, DDR_DQ23, DDR_DQS2_P, DDR_DQS2_N, DDR_DQ26, DDR_DQM2, DDR_DQ24, DDR_DQ28, DDR_DQ25, DDR_DQ27, DDR_DQ29, DDR_DQ30, DDR_DQ31, DDR_DQS3_P, DDR_DQS3_N, DDR_DQM3
DDR_A_C: DDR_CLK_P, DDR_CLK_N, DDR_A0, DDR_A1, DDR_A2, DDR_A3, DDR_A4, DDR_A5, DDR_A6, DDR_A7, DDR_A8, DDR_A9, DDR_CSN, DDR_CKE

### Nets
GND: C17.2 R27.2 U1.AB13(BYPASS_REG1V8)
VDD: R37.1 R38.1
VREF_DDR: C17.1 U1.AC20(DDR_VREF)
DDR_A0: U1.L20(DDR_A0) ; port DDR_A_C.DDR_A0
DDR_A1: U1.P22(DDR_A1) ; port DDR_A_C.DDR_A1
DDR_A2: U1.J20(DDR_A2) ; port DDR_A_C.DDR_A2
DDR_A3: U1.K22(DDR_A3) ; port DDR_A_C.DDR_A3
DDR_A4: U1.V20(DDR_A4) ; port DDR_A_C.DDR_A4
DDR_A5: U1.H20(DDR_A5) ; port DDR_A_C.DDR_A5
DDR_A6: U1.W20(DDR_A6) ; port DDR_A_C.DDR_A6
DDR_A7: U1.E20(DDR_A7) ; port DDR_A_C.DDR_A7
DDR_A8: U1.Y20(DDR_A8) ; port DDR_A_C.DDR_A8
DDR_A9: U1.G20(DDR_A9) ; port DDR_A_C.DDR_A9
DDR_CKE: U1.T20(DDR_CKE) ; port DDR_A_C.DDR_CKE
DDR_CLK_N: U1.N23(DDR_CLKN) ; port DDR_A_C.DDR_CLK_N
DDR_CLK_P: U1.N22(DDR_CLKP) ; port DDR_A_C.DDR_CLK_P
DDR_CSN: U1.M22(DDR_CSN) ; port DDR_A_C.DDR_CSN
DDR_DQ0: U1.E22(DDR_DQ0) ; port DDR_BYTE0&1.DDR_DQ0
DDR_DQ1: U1.F22(DDR_DQ1) ; port DDR_BYTE0&1.DDR_DQ1
DDR_DQ2: U1.H21(DDR_DQ2) ; port DDR_BYTE0&1.DDR_DQ2
DDR_DQ3: U1.E21(DDR_DQ3) ; port DDR_BYTE0&1.DDR_DQ3
DDR_DQ4: U1.J21(DDR_DQ4) ; port DDR_BYTE0&1.DDR_DQ4
DDR_DQ5: U1.J22(DDR_DQ5) ; port DDR_BYTE0&1.DDR_DQ5
DDR_DQ6: U1.H22(DDR_DQ6) ; port DDR_BYTE0&1.DDR_DQ6
DDR_DQ7: U1.G21(DDR_DQ7) ; port DDR_BYTE0&1.DDR_DQ7
DDR_DQ8: U1.T21(DDR_DQ8) ; port DDR_BYTE0&1.DDR_DQ8
DDR_DQ9: U1.U21(DDR_DQ9) ; port DDR_BYTE0&1.DDR_DQ9
DDR_DQ10: U1.T22(DDR_DQ10) ; port DDR_BYTE0&1.DDR_DQ10
DDR_DQ11: U1.W21(DDR_DQ11) ; port DDR_BYTE0&1.DDR_DQ11
DDR_DQ12: U1.W23(DDR_DQ12) ; port DDR_BYTE0&1.DDR_DQ12
DDR_DQ13: U1.T23(DDR_DQ13) ; port DDR_BYTE0&1.DDR_DQ13
DDR_DQ14: U1.W22(DDR_DQ14) ; port DDR_BYTE0&1.DDR_DQ14
DDR_DQ15: U1.Y21(DDR_DQ15) ; port DDR_BYTE0&1.DDR_DQ15
DDR_DQ16: U1.B22(DDR_DQ16) ; port DDR_BYTE2&3.DDR_DQ16
DDR_DQ17: U1.D22(DDR_DQ17) ; port DDR_BYTE2&3.DDR_DQ17
DDR_DQ18: U1.D23(DDR_DQ18) ; port DDR_BYTE2&3.DDR_DQ18
DDR_DQ19: U1.B21(DDR_DQ19) ; port DDR_BYTE2&3.DDR_DQ19
DDR_DQ20: U1.A21(DDR_DQ20) ; port DDR_BYTE2&3.DDR_DQ20
DDR_DQ21: U1.E23(DDR_DQ21) ; port DDR_BYTE2&3.DDR_DQ21
DDR_DQ22: U1.D21(DDR_DQ22) ; port DDR_BYTE2&3.DDR_DQ22
DDR_DQ23: U1.A22(DDR_DQ23) ; port DDR_BYTE2&3.DDR_DQ23
DDR_DQ24: U1.Y23(DDR_DQ24) ; port DDR_BYTE2&3.DDR_DQ24
DDR_DQ25: U1.Y22(DDR_DQ25) ; port DDR_BYTE2&3.DDR_DQ25
DDR_DQ26: U1.AB21(DDR_DQ26) ; port DDR_BYTE2&3.DDR_DQ26
DDR_DQ27: U1.AB20(DDR_DQ27) ; port DDR_BYTE2&3.DDR_DQ27
DDR_DQ28: U1.AC22(DDR_DQ28) ; port DDR_BYTE2&3.DDR_DQ28
DDR_DQ29: U1.AC21(DDR_DQ29) ; port DDR_BYTE2&3.DDR_DQ29
DDR_DQ30: U1.AA23(DDR_DQ30) ; port DDR_BYTE2&3.DDR_DQ30
DDR_DQ31: U1.AA22(DDR_DQ31) ; port DDR_BYTE2&3.DDR_DQ31
DDR_DQM0: U1.H23(DDR_DQM0) ; port DDR_BYTE0&1.DDR_DQM0
DDR_DQM1: U1.V22(DDR_DQM1) ; port DDR_BYTE0&1.DDR_DQM1
DDR_DQM2: U1.C23(DDR_DQM2) ; port DDR_BYTE2&3.DDR_DQM2
DDR_DQM3: U1.AA20(DDR_DQM3) ; port DDR_BYTE2&3.DDR_DQM3
DDR_DQS0_N: U1.G23(DDR_DQS0N) ; port DDR_BYTE0&1.DDR_DQS0_N
DDR_DQS0_P: U1.G22(DDR_DQS0P) ; port DDR_BYTE0&1.DDR_DQS0_P
DDR_DQS1_N: U1.U23(DDR_DQS1N) ; port DDR_BYTE0&1.DDR_DQS1_N
DDR_DQS1_P: U1.U22(DDR_DQS1P) ; port DDR_BYTE0&1.DDR_DQS1_P
DDR_DQS2_N: U1.B23(DDR_DQS2N) ; port DDR_BYTE2&3.DDR_DQS2_N
DDR_DQS2_P: U1.C22(DDR_DQS2P) ; port DDR_BYTE2&3.DDR_DQS2_P
DDR_DQS3_N: U1.AB23(DDR_DQS3N) ; port DDR_BYTE2&3.DDR_DQS3_N
DDR_DQS3_P: U1.AB22(DDR_DQS3P) ; port DDR_BYTE2&3.DDR_DQS3_P
I2C4_SCL: R37.2 U1.Y18(PD12) ; port I2C4_SCL
I2C4_SDA: R38.2 U1.AA19(PD13) ; port I2C4_SDA
NRST: U1.M3(NRST) ; port NRST
PA0_WKUP: U1.AB3(PA0) ; port PA0_WKUP
PWR_ON: U1.R2(PWR_ON) ; port PWR_ON
SDMMC2_CK: U1.C9(PE3) ; port SDMMC2_CK
SDMMC2_CMD: U1.A10(PG6) ; port SDMMC2_CMD
SDMMC2_D0: U1.C13(PB14)
SDMMC2_D1: U1.B12(PB15)
SDMMC2_D2: U1.A11(PB3)
SDMMC2_D3: U1.B13(PB4)
SDMMC2_D4: U1.A13(PA8)
SDMMC2_D5: U1.B10(PB9)
SDMMC2_D6: U1.C11(PE5)
SDMMC2_D7: U1.B11(PC7)
NetR27_1: R27.1 U1.K23(DDR_ZQ)

Not connected (* = marked no-connect by the designer): U1 A2(PH5)* A3(PE13)* A4(PE11)* A5(PF1)* A7(PD5)* A8(PA9)* A14(PF2)* A16(DSI_CKN)* A17(DSI_D1N)* A19(JTDO-TRACESWO)* A20(JTDI)* AA1(PG14)* AA2(PG13)* AA3(PH3)* AA4(PA1)* AA6(PC1)* AA7(PB1)* AA9(PE9)* AA10(PB13)* AA11(PE7)* AA13(PF6)* AA14(PF9)* AA18(PA11)* AB1(PB11)* AB2(PG4)* AB4(PH2)* AB5(PC0)* AB6(PB0)* AB7(PC5)* AB8(PA7)* AB9(PG8)* AB10(PB8)* AB11(PG10)* AB12(PF7)* AB16(USB_DM2)* AB17(USB_DM1)* AB18(USB_RREF)* AB19(PA12)* AC2(PG0)* AC3(PA2)* AC4(PF14)* AC5(PB12)* AC7(PC4)* AC8(PA6)* AC10(PD11)* AC11(PF8)* AC13(PE8)* AC14(PG7)* AC16(USB_DP2)* AC17(USB_DP1)* AC19(OTG_VBUS)* B1(PH15)* B2(PH12)* B3(PH4)* B4(PE12)* B5(PD10)* B6(PD4)* B7(PG15)* B8(PD0)* B9(PD1)* B14(PC6)* B15(DSI_D0N)* B16(DSI_CKP)* B17(DSI_D1P)* B19(NJTRST)* B20(JTCK-SWCLK)* C1(PI0)* C2(PH10)* C3(PH14)* C4(PH11)* C5(PH9)* C6(PE14)* C8(PE1)* C10(PE6)* C15(DSI_D0P)* C19(PA15)* C20(JTMS-SWDIO)* D1(PH13)* D2(PD6)* D3(PE15)* D5(PH8)* D6(PE0)* D7(PF5)* D8(PF0)* D9(PF4)* D10(PD7)* D11(PB7)* D12(PD2)* D13(PC12)* D14(PD3)* D15(PC10)* D16(PC11)* D17(PC9)* D18(PC8)* D19(PE4)* D20(DDR_RESETN)* E1(PI3)* E2(PI2)* E3(PI1)* E4(PI4)* F2(PI7)* F3(PI5)* F4(PI6)* F20(DDR_A13)* G1(PZ1)* G2(PZ4)* G3(PZ0)* G4(PZ3)* H1(PZ6)* H2(PZ5)* H4(PI9)* J2(PD15)* J3(PZ7)* J4(PZ2)* K1(PD9)* K2(PC13)* K3(PD8)* K4(PG12)* K20(DDR_DTO0)* L1(PC15-OSC32_OUT)* L2(PC14-OSC32_IN)* L3(PD14)* L4(PI8)* L21(DDR_DTO1)* L22(DDR_ODT)* L23(DDR_BA0)* M2(BOOT2)* M4(NRST_CORE)* M20(DDR_WEN)* M21(DDR_BA2)* N1(BOOT0)* N2(PA13)* N3(PWR_LP)* N4(BOOT1)* N20(DDR_CASN)* N21(DDR_RASN)* P1(PH0-OSC_IN)* P2(PH1-OSC_OUT)* P4(PI11)* P20(DDR_A15)* P23(DDR_A12)* R3(PDR_ON)* R20(DDR_A11)* R21(DDR_A14)* R22(DDR_A10)* T1(PI10)* T2(PA14)* T3(PDR_ON_CORE)* T4(PG3)* U1(PF3)* U2(PA3)* U3(ANA0)* U4(ANA1)* U20(DDR_BA1)* V2(PG2)* V3(PA5)* V4(PA4)* W1(PG1)* W2(PC3)* W4(PH7)* Y1(PE2)* Y2(PC2)* Y3(PB10)* Y4(PF15)* Y5(PF13)* Y6(PG5)* Y7(PG11)* Y8(PB5)* Y9(PF12)* Y10(PF11)* Y11(PH6)* Y12(PF10)* Y13(PG9)* Y14(PB6)* Y15(PE10)* Y16(PB2)* Y17(PA10)* Y19(DDR_ATO)*

### Buses and harness runs
bus SDMMC2_D[0..7] = port SDMMC2_D[0..7]

### Notes on the sheet
- eMMC
- POWER - PMIC
- Title:
- Project:
- Size:
- Revision:
- Variant:
- A3
- -
- Date:
- Reference:
- Sheet:
- of

### Library data of the parts
C17 = MCD-00006: as C78 on sheet eMMC; Internal_Part_Number: MCD-00006; Status: Released; Part_Type: Capacitor; Package: C0402; ComponentLink1Description: Datasheet; ComponentLink1URL: http://tunmcdsvn.tun.st.com/Component_Datasheet_Library/Trunk/Capacitors/Yageo_Multilayer_Capacitor_X7R_series_100pF_to_22uF
R27 = MCD-00120: Resistor,240R,0402,1%,1/16W; Manufacturer_Part_Number: RC0402FR-07240RL; Manufacturer: YAGEO; ECCN_US: EAR99; ECCN_EU: NEC; Provided_By: SUBCO; Internal_Part_Number: MCD-00120; ComponentLink1Description: Datasheet; Status: Released; Part_Type: Resistor; ComponentLink1URL: http://tunmcdsvn.tun.st.com/Component_Datasheet_Library/Trunk/Resistors/Yageo_Resistor_RC0402-series; Package: R0402
R37 R38 = MCD-00068: Resistor,1K5,0402,1%,1/16W; Manufacturer_Part_Number: RC0402FR-071K5L; Manufacturer: YAGEO; ECCN_US: EAR99; ECCN_EU: NEC; Provided_By: SUBCO; Internal_Part_Number: MCD-00068; ComponentLink1Description: Datasheet; Status: Released; Part_Type: Resistor; ComponentLink1URL: http://tunmcdsvn.tun.st.com/Component_Datasheet_Library/Trunk/Resistors/Yageo_Resistor_RC0402-series; Package: R0402
U1 = MCD-00677: as U1 on sheet Power_MPU; Internal_Part_Number: MCD-00677; Status: Footprint available; Manufacturer_Part_Number: STM32MP157CAC3; ComponentLink1Description: Datasheet; ComponentLink1URL: http://tunmcdsvn.tun.st.com/Component_Datasheet_Library/Trunk/IC/STM_MPU_12x12_POA_DM00342580_POA12x12

## Sheet 1LPDDR2_32bits .SchDoc: 1LPDDR2_32bits
size A3; Date: Not used; ApprovedBy: Not used; CheckedBy: Not used; Author: Not used; CompanyName: STMicroelectronics; DrawnBy: Not used; Engineer: Not used; Organization: Not used; Address1: Not used; Address2: Not used; Address3: Not used; Address4: Not used; DocumentNumber: Not used; Revision: Not used; SheetNumber: 7; SheetTotal: 7; CurrentTime: Not used; CurrentDate: Not used; Time: Not used; DocumentFullPathAndName: Not used; DocumentName: Not used; ModifiedDate: Not used; ImagePath: Not used; Application_BuildNumber: Not used
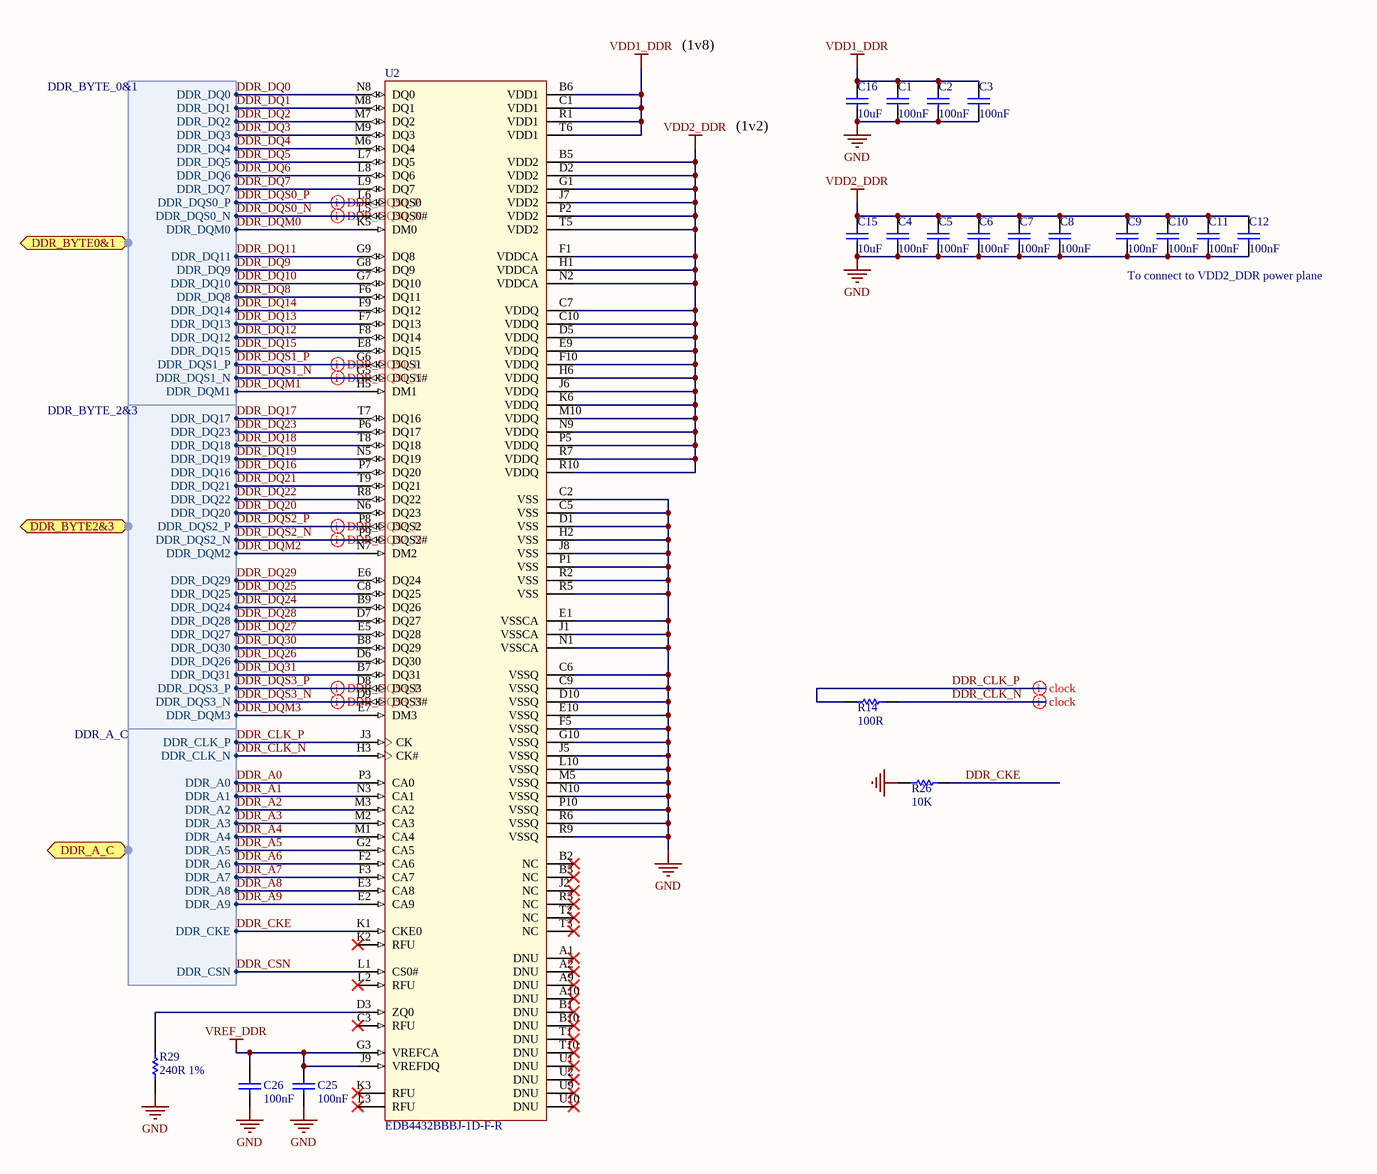
[diagram p6: 1LPDDR2_32bits .SchDoc]

### Parts
C1  value 100nF  [C0402]
C2  value 100nF  [C0402]
C3  value 100nF  [C0402]
C4  value 100nF  [C0402]
C5  value 100nF  [C0402]
C6  value 100nF  [C0402]
C7  value 100nF  [C0402]
C8  value 100nF  [C0402]
C9  value 100nF  [C0402]
C10  value 100nF  [C0402]
C11  value 100nF  [C0402]
C12  value 100nF  [C0402]
C15  value 10uF  [C0603]
C16  value 10uF  [C0603]
C25  value 100nF  [C0402]
C26  value 100nF  [C0402]
R14  value 100R  [R0402]
R26  value 10K  [R0402]
R29  value 240R 1%  [R0402]
U2  value EDB4432BBBJ-1D-F-R  [ICC_WFBGA134_SDP-SAC302_10X11P5_P065]

### Ports
DDR_A_C (harness DDR_A_C), DDR_BYTE0&1 (harness DDR_BYTE_0&1), DDR_BYTE2&3 (harness DDR_BYTE_2&3)

### Harnesses
DDR_BYTE_0&1: DDR_DQ0, DDR_DQ1, DDR_DQ2, DDR_DQ3, DDR_DQ4, DDR_DQ5, DDR_DQ6, DDR_DQ7, DDR_DQS0_P, DDR_DQS0_N, DDR_DQM0, DDR_DQ11, DDR_DQ9, DDR_DQ10, DDR_DQ8, DDR_DQ14, DDR_DQ13, DDR_DQ12, DDR_DQ15, DDR_DQS1_P, DDR_DQS1_N, DDR_DQM1
DDR_BYTE_2&3: DDR_DQ16, DDR_DQ17, DDR_DQ18, DDR_DQ23, DDR_DQ22, DDR_DQ19, DDR_DQ21, DDR_DQ20, DDR_DQS2_P, DDR_DQS2_N, DDR_DQ24, DDR_DQM2, DDR_DQ29, DDR_DQ27, DDR_DQ25, DDR_DQ28, DDR_DQ30, DDR_DQ26, DDR_DQ31, DDR_DQS3_P, DDR_DQS3_N, DDR_DQM3
DDR_A_C: DDR_CLK_P, DDR_CLK_N, DDR_A0, DDR_A1, DDR_A2, DDR_A3, DDR_A4, DDR_A5, DDR_A6, DDR_A7, DDR_A8, DDR_A9, DDR_CSN, DDR_CKE

### Nets
GND: C1.2 C2.2 C3.2 C4.2 C5.2 C6.2 C7.2 C8.2 C9.2 C10.2 C11.2 C12.2 C15.1 C16.1 C25.2 C26.2 R26.1 R29.1 U2.C2(VSS) U2.C5(VSS) U2.C6(VSSQ) U2.C9(VSSQ) U2.D1(VSS) U2.D10(VSSQ) U2.E1(VSSCA) U2.E10(VSSQ) U2.F5(VSSQ) U2.G10(VSSQ) U2.H2(VSS) U2.J1(VSSCA) U2.J5(VSSQ) U2.J8(VSS) U2.L10(VSSQ) U2.M5(VSSQ) U2.N1(VSSCA) U2.N10(VSSQ) U2.P1(VSS) U2.P10(VSSQ) U2.R2(VSS) U2.R5(VSS) U2.R6(VSSQ) U2.R9(VSSQ)
VDD1_DDR: C1.1 C2.1 C3.1 C16.2 U2.B6(VDD1) U2.C1(VDD1) U2.R1(VDD1) U2.T6(VDD1)
VDD2_DDR: C4.1 C5.1 C6.1 C7.1 C8.1 C9.1 C10.1 C11.1 C12.1 C15.2 U2.B5(VDD2) U2.C7(VDDQ) U2.C10(VDDQ) U2.D2(VDD2) U2.D5(VDDQ) U2.E9(VDDQ) U2.F1(VDDCA) U2.F10(VDDQ) U2.G1(VDD2) U2.H1(VDDCA) U2.H6(VDDQ) U2.J6(VDDQ) U2.J7(VDD2) U2.K6(VDDQ) U2.M10(VDDQ) U2.N2(VDDCA) U2.N9(VDDQ) U2.P2(VDD2) U2.P5(VDDQ) U2.R7(VDDQ) U2.R10(VDDQ) U2.T5(VDD2)
VREF_DDR: C25.1 C26.1 U2.G3(VREFCA) U2.J9(VREFDQ)
DDR_A0: U2.P3(CA0) ; port DDR_A_C.DDR_A0
DDR_A1: U2.N3(CA1) ; port DDR_A_C.DDR_A1
DDR_A2: U2.M3(CA2) ; port DDR_A_C.DDR_A2
DDR_A3: U2.M2(CA3) ; port DDR_A_C.DDR_A3
DDR_A4: U2.M1(CA4) ; port DDR_A_C.DDR_A4
DDR_A5: U2.G2(CA5) ; port DDR_A_C.DDR_A5
DDR_A6: U2.F2(CA6) ; port DDR_A_C.DDR_A6
DDR_A7: U2.F3(CA7) ; port DDR_A_C.DDR_A7
DDR_A8: U2.E3(CA8) ; port DDR_A_C.DDR_A8
DDR_A9: U2.E2(CA9) ; port DDR_A_C.DDR_A9
DDR_CKE: R26.2 U2.K1(CKE0) ; port DDR_A_C.DDR_CKE
DDR_CLK_N: R14.2 U2.H3(CK#) ; port DDR_A_C.DDR_CLK_N
DDR_CLK_P: R14.1 U2.J3(CK) ; port DDR_A_C.DDR_CLK_P
DDR_CSN: U2.L1(CS0#) ; port DDR_A_C.DDR_CSN
DDR_DQ0: U2.N8(DQ0) ; port DDR_BYTE0&1.DDR_DQ0
DDR_DQ1: U2.M8(DQ1) ; port DDR_BYTE0&1.DDR_DQ1
DDR_DQ2: U2.M7(DQ2) ; port DDR_BYTE0&1.DDR_DQ2
DDR_DQ3: U2.M9(DQ3) ; port DDR_BYTE0&1.DDR_DQ3
DDR_DQ4: U2.M6(DQ4) ; port DDR_BYTE0&1.DDR_DQ4
DDR_DQ5: U2.L7(DQ5) ; port DDR_BYTE0&1.DDR_DQ5
DDR_DQ6: U2.L8(DQ6) ; port DDR_BYTE0&1.DDR_DQ6
DDR_DQ7: U2.L9(DQ7) ; port DDR_BYTE0&1.DDR_DQ7
DDR_DQ8: U2.F6(DQ11) ; port DDR_BYTE0&1.DDR_DQ8
DDR_DQ9: U2.G8(DQ9) ; port DDR_BYTE0&1.DDR_DQ9
DDR_DQ10: U2.G7(DQ10) ; port DDR_BYTE0&1.DDR_DQ10
DDR_DQ11: U2.G9(DQ8) ; port DDR_BYTE0&1.DDR_DQ11
DDR_DQ12: U2.F8(DQ14) ; port DDR_BYTE0&1.DDR_DQ12
DDR_DQ13: U2.F7(DQ13) ; port DDR_BYTE0&1.DDR_DQ13
DDR_DQ14: U2.F9(DQ12) ; port DDR_BYTE0&1.DDR_DQ14
DDR_DQ15: U2.E8(DQ15) ; port DDR_BYTE0&1.DDR_DQ15
DDR_DQ16: U2.P7(DQ20) ; port DDR_BYTE2&3.DDR_DQ16
DDR_DQ17: U2.T7(DQ16) ; port DDR_BYTE2&3.DDR_DQ17
DDR_DQ18: U2.T8(DQ18) ; port DDR_BYTE2&3.DDR_DQ18
DDR_DQ19: U2.N5(DQ19) ; port DDR_BYTE2&3.DDR_DQ19
DDR_DQ20: U2.N6(DQ23) ; port DDR_BYTE2&3.DDR_DQ20
DDR_DQ21: U2.T9(DQ21) ; port DDR_BYTE2&3.DDR_DQ21
DDR_DQ22: U2.R8(DQ22) ; port DDR_BYTE2&3.DDR_DQ22
DDR_DQ23: U2.P6(DQ17) ; port DDR_BYTE2&3.DDR_DQ23
DDR_DQ24: U2.B9(DQ26) ; port DDR_BYTE2&3.DDR_DQ24
DDR_DQ25: U2.C8(DQ25) ; port DDR_BYTE2&3.DDR_DQ25
DDR_DQ26: U2.D6(DQ30) ; port DDR_BYTE2&3.DDR_DQ26
DDR_DQ27: U2.E5(DQ28) ; port DDR_BYTE2&3.DDR_DQ27
DDR_DQ28: U2.D7(DQ27) ; port DDR_BYTE2&3.DDR_DQ28
DDR_DQ29: U2.E6(DQ24) ; port DDR_BYTE2&3.DDR_DQ29
DDR_DQ30: U2.B8(DQ29) ; port DDR_BYTE2&3.DDR_DQ30
DDR_DQ31: U2.B7(DQ31) ; port DDR_BYTE2&3.DDR_DQ31
DDR_DQM0: U2.K5(DM0) ; port DDR_BYTE0&1.DDR_DQM0
DDR_DQM1: U2.H5(DM1) ; port DDR_BYTE0&1.DDR_DQM1
DDR_DQM2: U2.N7(DM2) ; port DDR_BYTE2&3.DDR_DQM2
DDR_DQM3: U2.E7(DM3) ; port DDR_BYTE2&3.DDR_DQM3
DDR_DQS0_N: U2.L5(DQS0#) ; port DDR_BYTE0&1.DDR_DQS0_N
DDR_DQS0_P: U2.L6(DQS0) ; port DDR_BYTE0&1.DDR_DQS0_P
DDR_DQS1_N: U2.G5(DQS1#) ; port DDR_BYTE0&1.DDR_DQS1_N
DDR_DQS1_P: U2.G6(DQS1) ; port DDR_BYTE0&1.DDR_DQS1_P
DDR_DQS2_N: U2.P9(DQS2#) ; port DDR_BYTE2&3.DDR_DQS2_N
DDR_DQS2_P: U2.P8(DQS2) ; port DDR_BYTE2&3.DDR_DQS2_P
DDR_DQS3_N: U2.D9(DQS3#) ; port DDR_BYTE2&3.DDR_DQS3_N
DDR_DQS3_P: U2.D8(DQS3) ; port DDR_BYTE2&3.DDR_DQS3_P
NetR29_2: R29.2 U2.D3(ZQ0)

Not connected (* = marked no-connect by the designer): U2 A1(DNU)* A2(DNU)* A9(DNU)* A10(DNU)* B1(DNU)* B2(NC)* B3(NC)* B10(DNU)* C3(RFU)* J2(NC)* K2(RFU)* K3(RFU)* L2(RFU)* L3(RFU)* R3(NC)* T1(DNU)* T2(NC)* T3(NC)* T10(DNU)* U1(DNU)* U2(DNU)* U9(DNU)* U10(DNU)*

### Layout directives
differential pair: DDR_CLK_N, DDR_CLK_P, DDR_DQS0_N, DDR_DQS0_P, DDR_DQS1_N, DDR_DQS1_P, DDR_DQS2_N, DDR_DQS2_P, DDR_DQS3_N, DDR_DQS3_P

### Notes on the sheet
- (1v8)
- (1v2)
- To connect to VDD2_DDR power plane
- Title:
- Project:
- Size:
- Revision:
- Variant:
- A3
- -
- Date:
- Reference:
- Sheet:
- of

### Library data of the parts
C1-C12 C25 C26 = MCD-00006: as C78 on sheet eMMC; Internal_Part_Number: MCD-00006; Status: Released; Part_Type: Capacitor; Package: C0402; ComponentLink1Description: Datasheet; ComponentLink1URL: http://tunmcdsvn.tun.st.com/Component_Datasheet_Library/Trunk/Capacitors/Yageo_Multilayer_Capacitor_X7R_series_100pF_to_22uF
C15 C16 = MCD-01124: Capacitor, MLCC, 10uF, 10V, X5R, 10%, 0603, T=0.8mm; Manufacturer_Part_Number: GRM188R61A106KAAL; Manufacturer: MURATA; Provided_By: SUBCO; ECCN_US: EAR99; ECCN_EU: NEC; Internal_Part_Number: MCD-01124; Status: Released; Part_Type: Capacitor; Package: C0603; ComponentLink1Description: Datasheet; ComponentLink1URL: http://tunmcdsvn.tun.st.com/Component_Datasheet_Library/Trunk/Capacitors/Murata_Capacitor_GR_series
R14 = MCD-00067: Resistor,100R,0402,1%,1/16W; Manufacturer_Part_Number: RC0402FR-07100RL; Manufacturer: YAGEO; Provided_By: SUBCO; ECCN_US: EAR99; ECCN_EU: NEC; Internal_Part_Number: MCD-00067; Status: Released; Part_Type: Resistor; Package: R0402; ComponentLink1Description: Datasheet; ComponentLink1URL: http://tunmcdsvn.tun.st.com/Component_Datasheet_Library/Trunk/Resistors/Yageo_Resistor_RC0402-series
R26 = MCD-00053: as R40 on sheet eMMC; Internal_Part_Number: MCD-00053; Status: Released; Part_Type: Resistor; Package: R0402; ComponentLink1Description: Datasheet; ComponentLink1URL: http://tunmcdsvn.tun.st.com/Component_Datasheet_Library/Trunk/Resistors/Yageo_Resistor_RC0402-series
R29 = MCD-00120: as R27 on sheet STM32_MPU_IOs; Internal_Part_Number: MCD-00120; Status: Released; Part_Type: Resistor; Package: R0402; ComponentLink1Description: Datasheet; ComponentLink1URL: http://tunmcdsvn.tun.st.com/Component_Datasheet_Library/Trunk/Resistors/Yageo_Resistor_RC0402-series
U2 = MCD-01223: Memory,LPDDR2,4Gb,128Mbx32,533MHz,1066Mb/s,1V8/1V2,FBGA134; Part_Type: IC; Manufacturer: MICRON; Provided_By: SUBCO; Internal_Part_Number: MCD-01223; Status: Released; Manufacturer_Part_Number: EDB4432BBBJ-1D-F-R; Package: WFBGA134 10x11.5; ComponentLink1Description: Datasheet; ComponentLink1URL: http://tunmcdsvn.tun.st.com/Component_Datasheet_Library/Trunk/IC/Micron_LPDDR2_134b_10x11.5_EDB4432BBBJ-1D-F-R; ECCN_US: n/a; ECCN_EU: n/a

## Nets that join several sheets
3V3: Power_PMIC (5 pins), eMMC (6 pins)
GND: Power_PMIC (28 pins), Power_MPU (86 pins), eMMC (17 pins), STM32_MPU_IOs (C17.2 R27.2 U1.AB13), 1LPDDR2_32bits  (42 pins)
VDD: Power_PMIC (6 pins), Power_MPU (15 pins), eMMC (8 pins), STM32_MPU_IOs (R37.1 R38.1)
VDD1_DDR: Power_PMIC (C46.2 U4.14), 1LPDDR2_32bits  (8 pins)
VDD2_DDR: Power_PMIC (C29.2 L2.2 U4.9), Power_MPU (16 pins), 1LPDDR2_32bits  (32 pins)
VDD_CORE: Power_PMIC (C34.2 L1.2 U4.5), Power_MPU (27 pins)
VDD_USB: Power_PMIC (C52.2 U4.39), Power_MPU (C71.2 U1.AA15 U1.AA17)
VDDA: Power_PMIC (C49.2 U4.20), Power_MPU (C70.2 R41.1 U1.1H1)
VREF_DDR: Power_PMIC (C84.2 U4.16), STM32_MPU_IOs (C17.1 U1.AC20), 1LPDDR2_32bits  (C25.1 C26.1 U2.G3 U2.J9)
DDR_A0: STM32_MPU_IOs (U1.L20), 1LPDDR2_32bits  (U2.P3)
DDR_A1: STM32_MPU_IOs (U1.P22), 1LPDDR2_32bits  (U2.N3)
DDR_A2: STM32_MPU_IOs (U1.J20), 1LPDDR2_32bits  (U2.M3)
DDR_A3: STM32_MPU_IOs (U1.K22), 1LPDDR2_32bits  (U2.M2)
DDR_A4: STM32_MPU_IOs (U1.V20), 1LPDDR2_32bits  (U2.M1)
DDR_A5: STM32_MPU_IOs (U1.H20), 1LPDDR2_32bits  (U2.G2)
DDR_A6: STM32_MPU_IOs (U1.W20), 1LPDDR2_32bits  (U2.F2)
DDR_A7: STM32_MPU_IOs (U1.E20), 1LPDDR2_32bits  (U2.F3)
DDR_A8: STM32_MPU_IOs (U1.Y20), 1LPDDR2_32bits  (U2.E3)
DDR_A9: STM32_MPU_IOs (U1.G20), 1LPDDR2_32bits  (U2.E2)
DDR_CKE: STM32_MPU_IOs (U1.T20), 1LPDDR2_32bits  (R26.2 U2.K1)
DDR_CLK_N: STM32_MPU_IOs (U1.N23), 1LPDDR2_32bits  (R14.2 U2.H3)
DDR_CLK_P: STM32_MPU_IOs (U1.N22), 1LPDDR2_32bits  (R14.1 U2.J3)
DDR_CSN: STM32_MPU_IOs (U1.M22), 1LPDDR2_32bits  (U2.L1)
DDR_DQ0: STM32_MPU_IOs (U1.E22), 1LPDDR2_32bits  (U2.N8)
DDR_DQ1: STM32_MPU_IOs (U1.F22), 1LPDDR2_32bits  (U2.M8)
DDR_DQ2: STM32_MPU_IOs (U1.H21), 1LPDDR2_32bits  (U2.M7)
DDR_DQ3: STM32_MPU_IOs (U1.E21), 1LPDDR2_32bits  (U2.M9)
DDR_DQ4: STM32_MPU_IOs (U1.J21), 1LPDDR2_32bits  (U2.M6)
DDR_DQ5: STM32_MPU_IOs (U1.J22), 1LPDDR2_32bits  (U2.L7)
DDR_DQ6: STM32_MPU_IOs (U1.H22), 1LPDDR2_32bits  (U2.L8)
DDR_DQ7: STM32_MPU_IOs (U1.G21), 1LPDDR2_32bits  (U2.L9)
DDR_DQ8: STM32_MPU_IOs (U1.T21), 1LPDDR2_32bits  (U2.F6)
DDR_DQ9: STM32_MPU_IOs (U1.U21), 1LPDDR2_32bits  (U2.G8)
DDR_DQ10: STM32_MPU_IOs (U1.T22), 1LPDDR2_32bits  (U2.G7)
DDR_DQ11: STM32_MPU_IOs (U1.W21), 1LPDDR2_32bits  (U2.G9)
DDR_DQ12: STM32_MPU_IOs (U1.W23), 1LPDDR2_32bits  (U2.F8)
DDR_DQ13: STM32_MPU_IOs (U1.T23), 1LPDDR2_32bits  (U2.F7)
DDR_DQ14: STM32_MPU_IOs (U1.W22), 1LPDDR2_32bits  (U2.F9)
DDR_DQ15: STM32_MPU_IOs (U1.Y21), 1LPDDR2_32bits  (U2.E8)
DDR_DQ16: STM32_MPU_IOs (U1.B22), 1LPDDR2_32bits  (U2.P7)
DDR_DQ17: STM32_MPU_IOs (U1.D22), 1LPDDR2_32bits  (U2.T7)
DDR_DQ18: STM32_MPU_IOs (U1.D23), 1LPDDR2_32bits  (U2.T8)
DDR_DQ19: STM32_MPU_IOs (U1.B21), 1LPDDR2_32bits  (U2.N5)
DDR_DQ20: STM32_MPU_IOs (U1.A21), 1LPDDR2_32bits  (U2.N6)
DDR_DQ21: STM32_MPU_IOs (U1.E23), 1LPDDR2_32bits  (U2.T9)
DDR_DQ22: STM32_MPU_IOs (U1.D21), 1LPDDR2_32bits  (U2.R8)
DDR_DQ23: STM32_MPU_IOs (U1.A22), 1LPDDR2_32bits  (U2.P6)
DDR_DQ24: STM32_MPU_IOs (U1.Y23), 1LPDDR2_32bits  (U2.B9)
DDR_DQ25: STM32_MPU_IOs (U1.Y22), 1LPDDR2_32bits  (U2.C8)
DDR_DQ26: STM32_MPU_IOs (U1.AB21), 1LPDDR2_32bits  (U2.D6)
DDR_DQ27: STM32_MPU_IOs (U1.AB20), 1LPDDR2_32bits  (U2.E5)
DDR_DQ28: STM32_MPU_IOs (U1.AC22), 1LPDDR2_32bits  (U2.D7)
DDR_DQ29: STM32_MPU_IOs (U1.AC21), 1LPDDR2_32bits  (U2.E6)
DDR_DQ30: STM32_MPU_IOs (U1.AA23), 1LPDDR2_32bits  (U2.B8)
DDR_DQ31: STM32_MPU_IOs (U1.AA22), 1LPDDR2_32bits  (U2.B7)
DDR_DQM0: STM32_MPU_IOs (U1.H23), 1LPDDR2_32bits  (U2.K5)
DDR_DQM1: STM32_MPU_IOs (U1.V22), 1LPDDR2_32bits  (U2.H5)
DDR_DQM2: STM32_MPU_IOs (U1.C23), 1LPDDR2_32bits  (U2.N7)
DDR_DQM3: STM32_MPU_IOs (U1.AA20), 1LPDDR2_32bits  (U2.E7)
DDR_DQS0_N: STM32_MPU_IOs (U1.G23), 1LPDDR2_32bits  (U2.L5)
DDR_DQS0_P: STM32_MPU_IOs (U1.G22), 1LPDDR2_32bits  (U2.L6)
DDR_DQS1_N: STM32_MPU_IOs (U1.U23), 1LPDDR2_32bits  (U2.G5)
DDR_DQS1_P: STM32_MPU_IOs (U1.U22), 1LPDDR2_32bits  (U2.G6)
DDR_DQS2_N: STM32_MPU_IOs (U1.B23), 1LPDDR2_32bits  (U2.P9)
DDR_DQS2_P: STM32_MPU_IOs (U1.C22), 1LPDDR2_32bits  (U2.P8)
DDR_DQS3_N: STM32_MPU_IOs (U1.AB23), 1LPDDR2_32bits  (U2.D9)
DDR_DQS3_P: STM32_MPU_IOs (U1.AB22), 1LPDDR2_32bits  (U2.D8)
I2C4_SCL: Power_PMIC (U4.4), STM32_MPU_IOs (R37.2 U1.Y18)
I2C4_SDA: Power_PMIC (U4.3), STM32_MPU_IOs (R38.2 U1.AA19)
NRST: Power_PMIC (U4.1), STM32_MPU_IOs (U1.M3)
PA0_WKUP: Power_PMIC (U4.43), STM32_MPU_IOs (U1.AB3)
PWR_ON: Power_PMIC (U4.44), STM32_MPU_IOs (U1.R2)

## Assembly variants
Example: all parts fitted